# EasyEDA Pro project FC_F4_V2.0_2026-02-21.epro

# Schematic FC_F4_V2.0
Board Name: Board1; Create Date: 2026-01-18; Page Name: P1; Project Name: 莺飞; Schematic Name: Schematic8; Update Date: 2026-01-18; BladeWidth: 10; Company: 嘉立创EDA; Page Size: A4; RegionStart: 1; ShowBorder: 1; TitleBlock: 1; TitleBlockPosition: 3; Version: V1.0; XRegionCount: 6; YRegionCount: 4
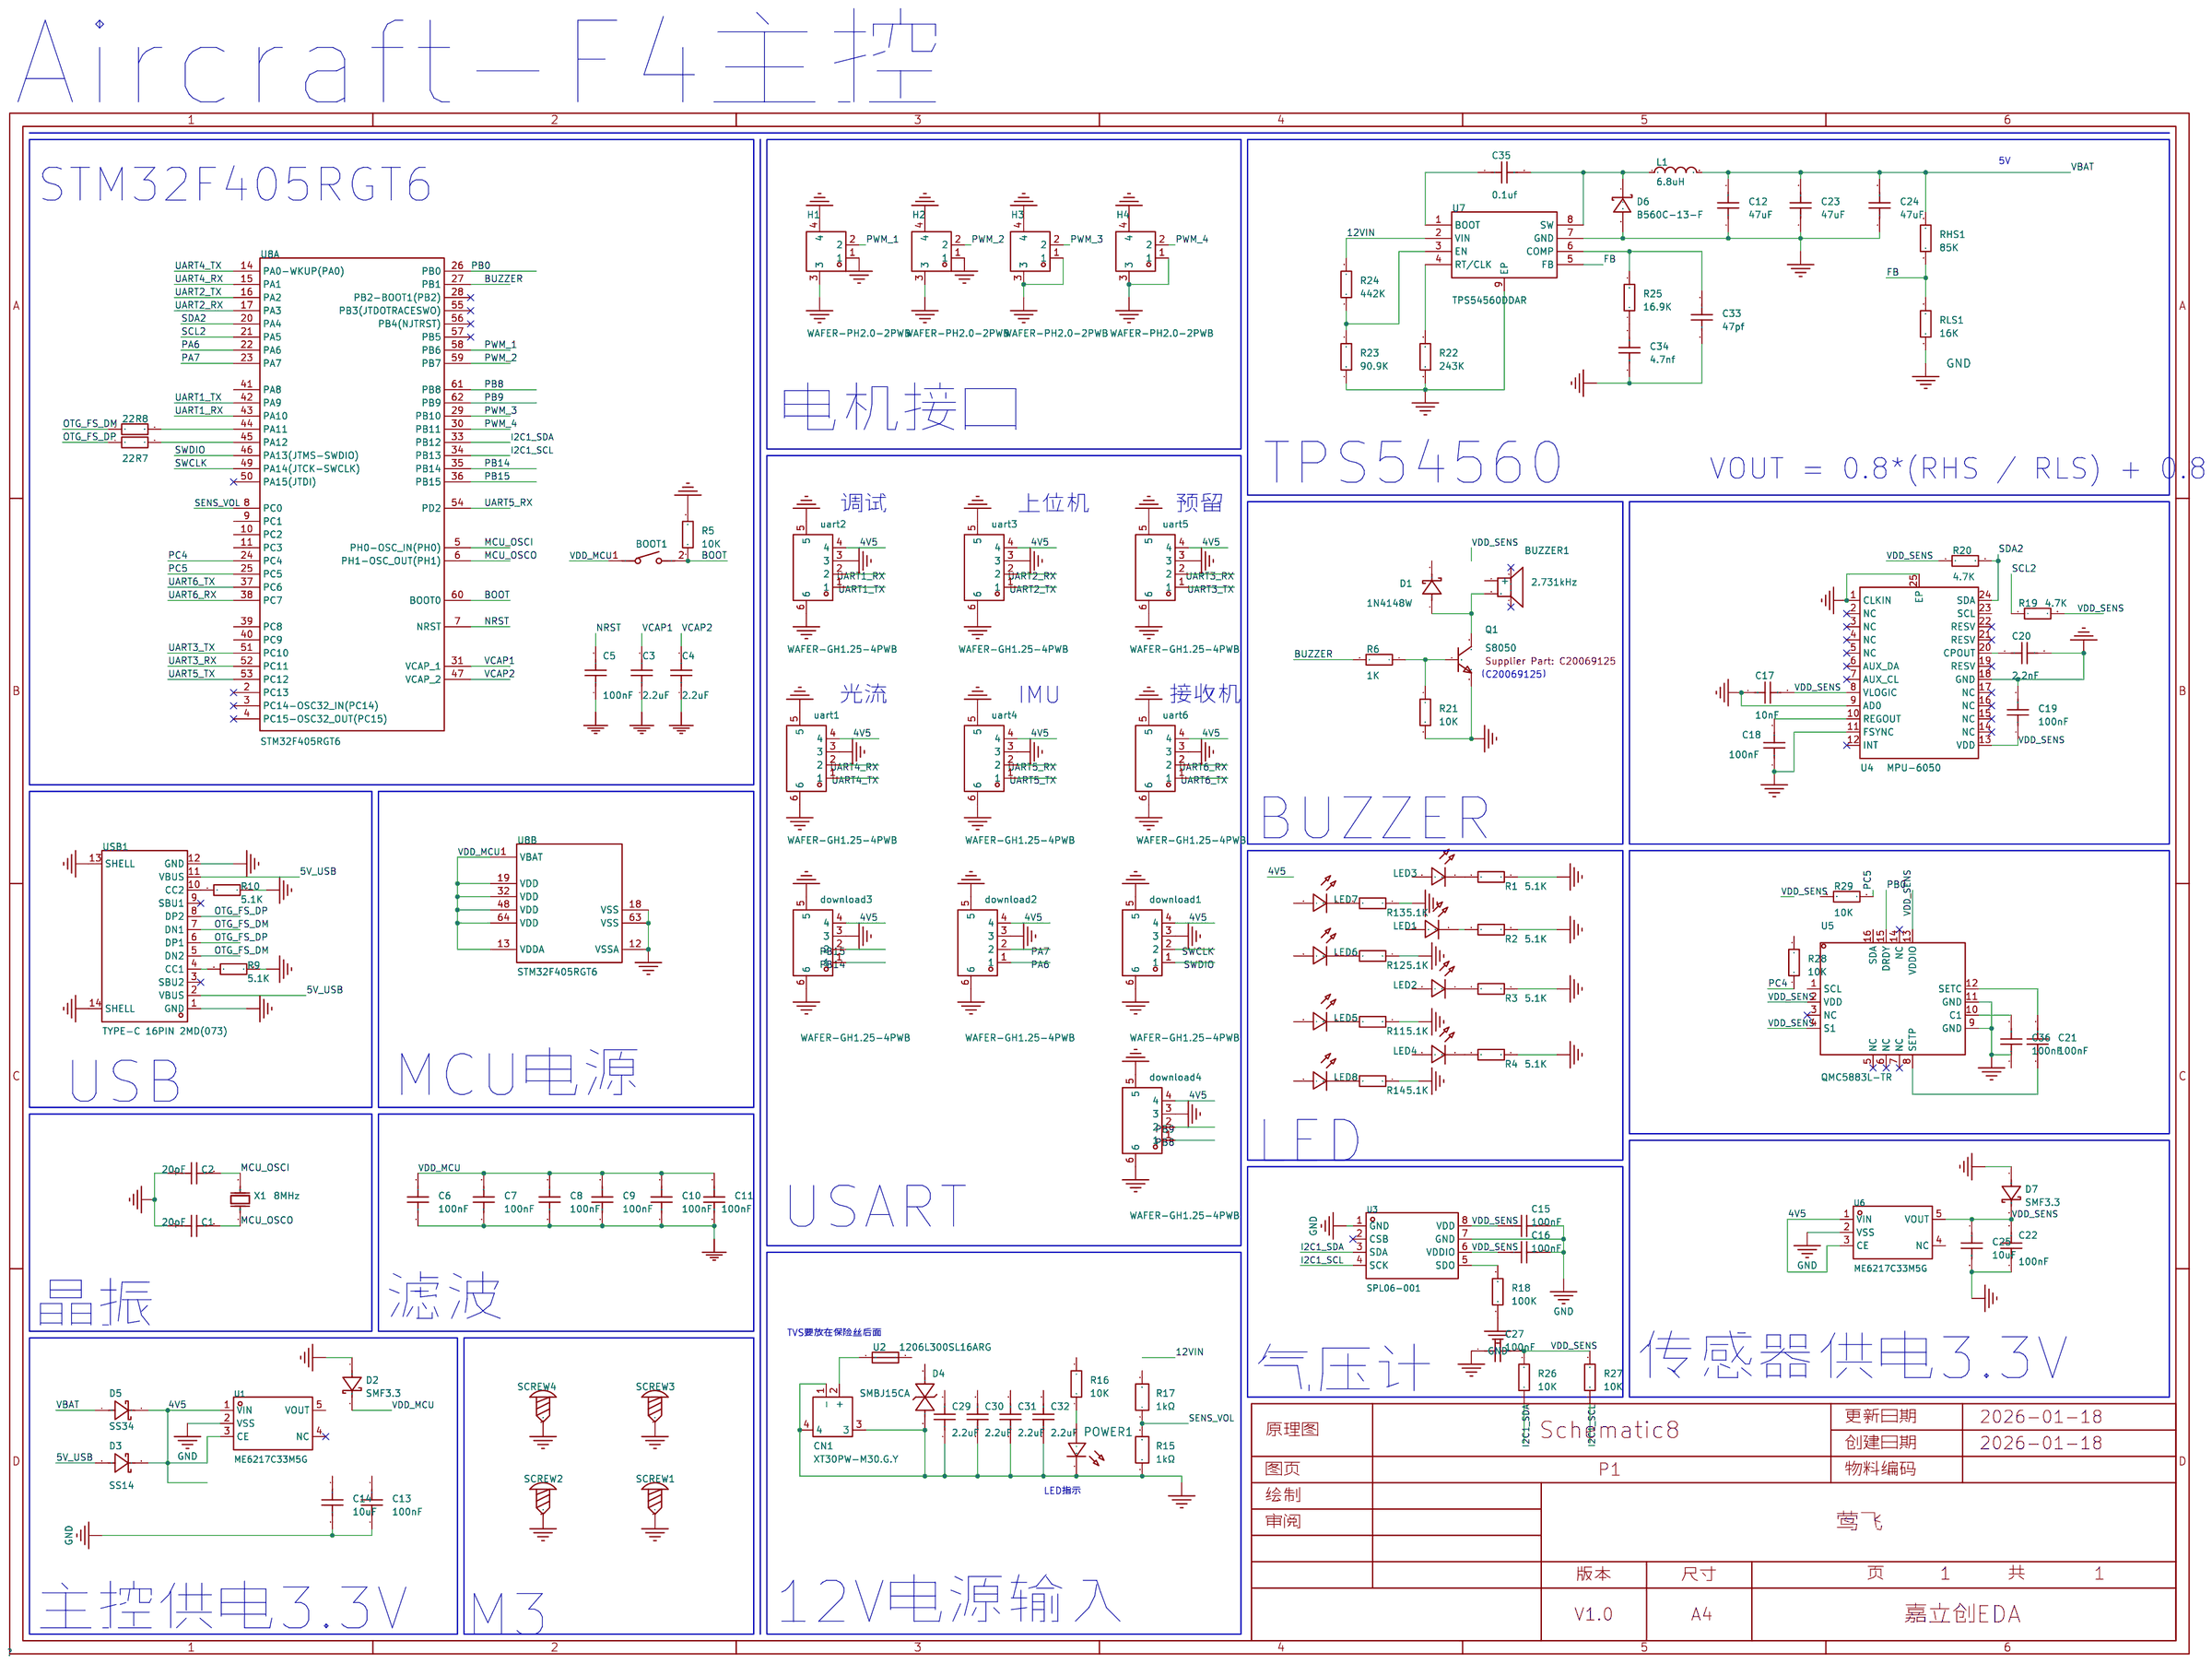
[diagram p0: schematic sheet]

## Parts
BOOT1  TS-1088-AR02016  [SW-SMD_L3.9-W3.0-P4.45_1]
BUZZER1  2.731kHz  [BUZ-SMD_4P-L7.5-W7.5-BR_1]
C1  20pF  [C0603]
C2  20pF  [C0603]
C3  2.2uF  [C0603]
C4  2.2uF  [C0603]
C5  100nF  [C0603]
C6  100nF  [C0603]
C7  100nF  [C0603]
C8  100nF  [C0603]
C9  100nF  [C0603]
C10  100nF  [C0603]
C11  100nF  [C0603]
C12  47uF  [C0805]
C13  100nF  [C0603]
C14  10uF  [C0603]
C15  100nF  [C0603]
C16  100nF  [C0603]
C17  10nF  [C0603]
C18  100nF  [C0603]
C19  100nF  [C0603]
C20  2.2nF  [C0603]
C21  100nF  [C0603]
C22  100nF  [C0603]
C23  47uF  [C0805]
C24  47uF  [C0805]
C25  10uF  [C0603]
C27  100nF  [C0603]
C29  2.2uF  [C1206]
C30  2.2uF  [C1206]
C31  2.2uF  [C1206]
C32  2.2uF  [C1206]
C33  47pf  [C0603]
C34  4.7nf  [C0603]
C35  0.1uf  [C0603]
C36  100nF  [C0603]
CN1  XT30PW-M30.G.Y  [CONN-TH_XT30PW-M]
D1  1N4148W  [SOD-123_L2.7-W1.6-LS3.7-FD_1]
D2  SMF3.3  [SOD-123FL_L3.0-W1.9-LS3.7-FD]
D3  SS14  [SMA_L4.3-W2.6-LS5.0-FD]
D4  SMBJ15CA  [SMB_L4.6-W3.6-LS5.4-BI]
D5  SS34  [SMA_L4.3-W2.6-LS5.0-FD]
D6  B560C-13-F  [SMC_L7.1-W6.2-LS8.1-RD]
D7  SMF3.3  [SOD-123FL_L3.0-W1.9-LS3.7-FD]
download1  WAFER-GH1.25-4PWB  [CONN-SMD_4P-P1.25_XUNPU_WAFER-GH1.25-4PWB_1]
download2  WAFER-GH1.25-4PWB  [CONN-SMD_4P-P1.25_XUNPU_WAFER-GH1.25-4PWB_1]
download3  WAFER-GH1.25-4PWB  [CONN-SMD_4P-P1.25_XUNPU_WAFER-GH1.25-4PWB_1]
download4  WAFER-GH1.25-4PWB  [CONN-SMD_4P-P1.25_XUNPU_WAFER-GH1.25-4PWB_1]
H1  WAFER-PH2.0-2PWB  [CONN-SMD_2P-P2.00_XUNPU_WAFER-PH2.0-2PWB_1]
H2  WAFER-PH2.0-2PWB  [CONN-SMD_2P-P2.00_XUNPU_WAFER-PH2.0-2PWB_1]
H3  WAFER-PH2.0-2PWB  [CONN-SMD_2P-P2.00_XUNPU_WAFER-PH2.0-2PWB_1]
H4  WAFER-PH2.0-2PWB  [CONN-SMD_2P-P2.00_XUNPU_WAFER-PH2.0-2PWB_1]
L1  6.8uH  [IND-SMD_L4.4-W4.2]
LED1  -  [LED_606]
LED2  -  [LED_606]
LED3  -  [LED_606]
LED4  -  [LED_606]
LED5  -  [LED_606]
LED6  -  [LED_606]
LED7  -  [LED_606]
LED8  -  [LED_606]
POWER1  -  [LED_604]
Q1  S8050  [SOT-23-3_L2.9-W1.3-P1.90-LS2.3-BR_1]
R1  5.1K  [R0603_5]
R2  5.1K  [R0603_5]
R3  5.1K  [R0603_5]
R4  5.1K  [R0603_5]
R5  10K  [R0603]
R6  1K  [R0603]
R7  22  [R0402]
R8  22  [R0402]
R9  5.1K  [R0603]
R10  5.1K  [R0603]
R11  5.1K  [R0603_5]
R12  5.1K  [R0603_5]
R13  5.1K  [R0603_5]
R14  5.1K  [R0603_5]
R15  1kΩ  [R2512]
R16  10K  [R0603]
R17  1kΩ  [R2512]
R18  100K  [R0603]
R19  4.7K  [R0603]
R20  4.7K  [R0603]
R21  10K  [R0603]
R22  243K  [R0603]
R23  90.9K  [R0603]
R24  442K  [R0603]
R25  16.9K  [R0603]
R26  10K  [R0603]
R27  10K  [R0603]
R28  10K  [R0603]
R29  10K  [R0603]
RHS1  85K  [R0603]
RLS1  16K  [R0603]
SCREW1  -  [M3螺丝_2]
SCREW2  -  [M3螺丝_2]
SCREW3  -  [M3螺丝_2]
SCREW4  -  [M3螺丝_2]
U1  ME6217C33M5G  [SOT-23-5_L3.0-W1.7-P0.95-LS2.8-BR]
U2  1206L300SL16ARG  [L1206]
U3  SPL06-001  [SENSOR-SMD_SPL06-001]
U4  MPU-6050  [QFN-24_L4.0-W4.0-P0.50-BL-EP2.7]
U5  QMC5883L-TR  [LGA-16_L3.0-W3.0-P0.50-BL_SQ]
U6  ME6217C33M5G  [SOT-23-5_L3.0-W1.7-P0.95-LS2.8-BR]
U7  TPS54560DDAR  [SOIC-8_L5.0-W4.0-P1.27-LS6.0-BL-EP2.0]
U8  STM32F405RGT6  [LQFP-64_L10.0-W10.0-P0.50-LS12.0-BL_1]  (sections 1,2)
uart1  WAFER-GH1.25-4PWB  [CONN-SMD_4P-P1.25_XUNPU_WAFER-GH1.25-4PWB_1]
uart2  WAFER-GH1.25-4PWB  [CONN-SMD_4P-P1.25_XUNPU_WAFER-GH1.25-4PWB_1]
uart3  WAFER-GH1.25-4PWB  [CONN-SMD_4P-P1.25_XUNPU_WAFER-GH1.25-4PWB_1]
uart4  WAFER-GH1.25-4PWB  [CONN-SMD_4P-P1.25_XUNPU_WAFER-GH1.25-4PWB_1]
uart5  WAFER-GH1.25-4PWB  [CONN-SMD_4P-P1.25_XUNPU_WAFER-GH1.25-4PWB_1]
uart6  WAFER-GH1.25-4PWB  [CONN-SMD_4P-P1.25_XUNPU_WAFER-GH1.25-4PWB_1]
USB1  TYPE-C 16PIN 2MD(073)  [USB-C-SMD_TYPE-C-6PIN-2MD-073_2]
X1  8MHz  [OSC-SMD_L5.0-W3.2_1]

## Library data of the parts
BOOT1 = TS-1088-AR02016_1: LCSC Part Name: 4*3*2mm 立贴 轻触开关; Supplier Part: C720477; Manufacturer: XUNPU(讯普); Supplier Footprint: SMD; JLCPCB Part Class: 扩展库; Datasheet: https://atta.szlcsc.com/upload/public/pdf/source/20200810/C720475_60D09DD6C54279ADDB2DC25100F1CC11.pdf; Supplier: LCSC; Contact Current: 50mA; Voltage Rating (DC): 12V; Insulation Resistance: 100MΩ; Circuit: 单刀单掷; Mounting Style: 立贴; Actuator Style: 圆形按钮; Actuator/Cap Color: 黑色; Operating Force: 160gf@±50gf; Mechanical Life: 10万次; Operating Temperature: -30℃~+80℃; Pin Style: SMD接片; Switch Length: 4mm; Switch Width: 3mm; Switch Height: 2mm; Strike Gundam: 否
BUZZER1 = HYG-7525A_1: LCSC Part Name: 贴片无源蜂鸣器; Supplier Part: C7544812; Manufacturer: HYDZ(华宇); Manufacturer Part: HYG-7525A; Supplier Footprint: SMD,7.5x7.5mm; Datasheet: https://item.szlcsc.com/datasheet/HYG-7525A/8653386.html; Supplier: LCSC; Current Consumption: 90mA; Sound Pressure Level(SPL): 85dB
C1 C2 = HHV0603G0200J251NTHJ_1: 容值:20pF;额定电压:250V;材质(温度系数):C0G;; LCSC Part Name: 20pF 250V; Supplier Part: C5186672; Manufacturer: Chinocera(华瓷); Manufacturer Part: HHV0603G0200J251NTHJ; Supplier Footprint: 0603; JLCPCB Part Class: 扩展库; Datasheet: https://atta.szlcsc.com/upload/public/pdf/source/20240320/7913236AA18747E5EA43CE828F8C8ED9.pdf; Supplier: LCSC; Voltage Rated: 250V; Temperature Coefficient: C0G
C3-C11 C13-C22 C25 C27 C33-C36 = CAP_0603: Supplier Footprint: 0603
C12 C23 C24 = CAP_0805: Supplier Footprint: 0805
C29-C32 = CAP_1206: Supplier Footprint: 1206
CN1 = XT30PW-M30.G.Y: LCSC Part Name: AMASS(艾迈斯)航模插头 卧式弯脚 XT30PW-M公头; Supplier Part: C431092; Manufacturer: AMASS(艾迈斯); JLCPCB Part Class: Extended Part; Datasheet: https://item.szlcsc.com/datasheet/XT30PW-M30.G.Y/426930.html; Supplier: LCSC; Type: 航模插头; RatedVoltage: DC 500V; InterfaceType: 公头; RatedCurrent: 15A; RecommendedWireGauge: 16/18/20AWG; contact resistance: 1.2mΩ; specifications: 2pin
D1 = 1N4148W_C7420318_1: Supplier Part: C7420318; Manufacturer: R+O(宏嘉诚); Supplier Footprint: SOD-123; Datasheet: https://item.szlcsc.com/datasheet/1N4148W/8397140.html; Supplier: LCSC; Diode Configuration: 独立式; Voltage - Forward(Vf@If): 1.25V@150mA; Voltage - DC Reverse(Vr): 100V; Current - Rectified: 150mA; Pd - Power Dissipation: 400mW; Reverse Leakage Current (Ir): 1uA@75V; Reverse Recovery Time (trr): 4ns; Operating Junction Temperature Range: -55℃~+150℃; Non-Repetitive Peak Forward Surge Current: 2A
D2 D7 = SMF3.3: LCSC Part Name: TVS 3.3V截止 峰值浪涌电流：30A; Supplier Part: C2649858; Manufacturer: Littelfuse(美国力特); Supplier Footprint: SOD-123FL; JLCPCB Part Class: Extended Part; Datasheet: https://item.szlcsc.com/datasheet/SMF3.3/2741767.html; Supplier: LCSC; Reverse Stand-Off Voltage (Vrwm): 3.3V; Clamping Voltage: 6.8V; Peak Pulse Current (Ipp): 30A; Peak Pulse Power Dissipation (Ppp): 200W; Voltage - Breakdown: 3.4V; Reverse Leakage Current (Ir): 500nA; Operating Temperature: -55℃~+150℃; level of protection: IEC 61000-4-4；IEC 61000-4-2; Type: TVS
D3 = SS14_C7420316: 二极管配置:独立式;正向压降(Vf):550mV@1.0A;直流反向耐压(Vr):40V;整流电流:1A;; LCSC Part Name: 电压:40V 电流:1A; Supplier Part: C7420316; Manufacturer: R+O(宏嘉诚); Supplier Footprint: SMA(DO-214AC); JLCPCB Part Class: 扩展库; Datasheet: https://item.szlcsc.com/datasheet/SS14/8397138.html; Supplier: LCSC; Diode Configuration: 独立式; Voltage - Forward(Vf@If): 550mV@1.0A; Voltage - DC Reverse(Vr): 40V; Current - Rectified: 1A; Reverse Leakage Current (Ir): 200uA@40V; Operating Junction Temperature Range: -55℃~+150℃; Non-Repetitive Peak Forward Surge Current: 30A
D4 = SMBJ15CA_C19077570: 极性:双向;反向截止电压(Vrwm):15V;钳位电压:24.4V;峰值脉冲电流(Ipp):24.59A@10/1000us;峰值脉冲功率(Ppp):600W@10/1000us;击穿电压:18.5V;; LCSC Part Name: 双向TVS 15V截止 峰值浪涌电流：24.59A@10/1000us; Supplier Part: C19077570; Manufacturer: R+O(宏嘉诚); Supplier Footprint: DO-214AA(SMB); JLCPCB Part Class: 扩展库; Datasheet: https://item.szlcsc.com/datasheet/SMBJ15CA/20275655.html; Supplier: LCSC; Polarity: 双向; Reverse Stand-Off Voltage (Vrwm): 15V; Clamping Voltage: 24.4V; Peak Pulse Current (Ipp): 24.59A@10/1000us; Peak Pulse Power Dissipation (Ppp): 600W@10/1000us; Voltage - Breakdown: 18.5V; Reverse Leakage Current (Ir): 5uA; Operating Temperature: -55℃~+150℃; level of protection: IEC 61000-4-2; Type: TVS
D5 = SS34_C7420365: 二极管配置:独立式;正向压降(Vf):550mV@3.0A;直流反向耐压(Vr):40V;整流电流:3A;; LCSC Part Name: 电压:40V 电流:3A; Supplier Part: C7420365; Manufacturer: R+O(宏嘉诚); Supplier Footprint: SMA(DO-214AC); JLCPCB Part Class: Extended Part; Datasheet: https://item.szlcsc.com/datasheet/SS34/8397187.html; Supplier: LCSC; Diode Configuration: 独立式; Voltage - Forward(Vf@If): 550mV@3.0A; Voltage - DC Reverse(Vr): 40V; Current - Rectified: 3A; Reverse Leakage Current (Ir): 200uA@40V
D6 = B560C-13-F: 正向压降(Vf):700mV@5A;直流反向耐压(Vr):60V;整流电流:5A;; LCSC Part Name: 电压:60V 电流:5A; Supplier Part: C85100; Manufacturer: DIODES(美台); Supplier Footprint: SMC(DO-214AB); JLCPCB Part Class: Extended Part; Datasheet: https://item.szlcsc.com/datasheet/B560C-13-F/86272.html; Supplier: LCSC; Voltage - Forward(Vf@If): 700mV@5A; Voltage - DC Reverse(Vr): 60V; Current - Rectified: 5A; Reverse Leakage Current (Ir): 500uA@60V; Operating Junction Temperature Range: -55℃~+150℃; Non-Repetitive Peak Forward Surge Current: 100A
download1-download4 uart1-uart6 = WAFER-GH1.25-4PWB_1: 插针结构:1x4P;间距:1.25mm;安装方式:卧贴;参考系列:GH;总PIN数:4P;排数:1;每排PIN数:4;行距:-;额定电流:1A;触头材质:黄铜;触头镀层:锡;工作温度:-25℃~+85℃;; LCSC Part Name: 1x4P 间距:1.25mm 卧贴 系列:GH; Supplier Part: C3029379; Manufacturer: XUNPU(讯普); Supplier Footprint: SMD,P=1.25mm,卧贴; JLCPCB Part Class: Extended Part; Datasheet: https://item.szlcsc.com/datasheet/WAFER-GH1.25-4PWB/3561391.html; Supplier: LCSC; Pins Structure: 1x4P; Pitch: 1.25mm; Mounting Type: 卧贴; Reference Series: GH; Number of Pins: 4P; Number of Rows: 1; Number of PINs Per Row: 4; Current Rating: 1A; Contact Material: 黄铜; Contact Plating: 锡; Operating Temperature: -25℃~+85℃; Voltage Rating: 125V; Plastic Material: LCP; Supplementary Features: 辅助焊脚; Color: 米色; Z-Height of the Board: 4.35mm; X-Length of Bottom Edge on Board (Spacing Line): 8.25mm; Y-Width of Bottom Edge on Board: 5mm
H1-H4 = WAFER-PH2.0-2PWB_1: 插针结构:1x2P;间距:2mm;安装方式:卧贴;参考系列:PH;总PIN数:2P;排数:1;每排PIN数:2;行距:-;额定电流:2A;触头材质:黄铜;触头镀层:锡;工作温度:-25℃~+85℃;; LCSC Part Name: 1x2P 间距:2mm 卧贴 系列:PH; Supplier Part: C3029440; Manufacturer: XUNPU(讯普); Supplier Footprint: SMD,P=2mm,卧贴; JLCPCB Part Class: Extended Part; Datasheet: https://item.szlcsc.com/datasheet/WAFER-PH2.0-2PWB/3561452.html; Supplier: LCSC; Pins Structure: 1x2P; Pitch: 2mm; Mounting Type: 卧贴; Reference Series: PH; Number of Pins: 2P; Number of Rows: 1; Number of PINs Per Row: 2; Current Rating: 2A; Contact Material: 黄铜; Contact Plating: 锡; Operating Temperature: -25℃~+85℃; Voltage Rating: 250V; Plastic Material: LCP; Supplementary Features: 辅助焊脚; Color: 米色; Z-Height of the Board: 5.6mm; X-Length of Bottom Edge on Board (Spacing Line): 8mm; Y-Width of Bottom Edge on Board: 7.59mm
L1 = FAUL0420-6R8MT: 电感值:6.8uH;精度:±20%;额定电流:2.4A;饱和电流(Isat):2.5A;类型:-;; LCSC Part Name: 6.8uH ±20% 2.5A; Supplier Part: C3040386; Manufacturer: cjiang(长江微电); Supplier Footprint: SMD,4.4x4.2mm; JLCPCB Part Class: Extended Part; Datasheet: https://item.szlcsc.com/datasheet/FAUL0420-6R8MT/3597563.html; Supplier: LCSC; Tolerance: ±20%; Current Rating: 2.4A; Current - Saturation(Isat): 2.5A; DC Resistance(DCR): 175mΩ; Ratings: AEC-Q200
LED1-LED8 = LED_0603-G_1: Supplier Footprint: 0603
POWER1 = LED_0603-R_1: Supplier Footprint: 0603
Q1 = S8050_C20069125_1: LCSC Part Name: hFE:200-350，丝印:J3Y S8050; Supplier Part: C20069125; Manufacturer: R+O(宏嘉诚); Supplier Footprint: SOT-23; Datasheet: https://item.szlcsc.com/datasheet/S8050/21397163.html; Supplier: LCSC; type: NPN; Current - Collector(Ic): 500mA; Collector - Emitter Voltage VCEO: 25V; Pd - Power Dissipation: 300mW; DC Current Gain: 120@50mA,1.0V; Transition frequency(fT): 100MHz; Current - Collector Cutoff: 100nA; Vce Saturation(VCE(sat)): 600mV@500mA,50mA; Operating Temperature: -55℃~+150℃; Emitter-Base Voltage(Vebo): 5V
R1-R4 R11-R14 = Res_605: Supplier Footprint: 0603
R5 R6 R9 R10 R16 R18-R29 RHS1 RLS1 = Res_0603: Supplier Footprint: 0603
R7 R8 = Res_0402: Supplier Footprint: 0402
R15 R17 = HoCR2512-2W-1KR-5%: 电阻类型:陶瓷电阻;阻值:1kΩ;精度:±5%;功率:2W;温度系数:-;; LCSC Part Name: 陶瓷电阻 1kΩ ±5% 2W; Supplier Part: C5123626; Manufacturer: Milliohm(毫欧); Supplier Footprint: 2512; JLCPCB Part Class: Extended Part; Datasheet: https://atta.szlcsc.com/upload/public/pdf/source/20220815/B2B22E44E42BA53361D26D7F91BAD205.pdf; Supplier: LCSC; Type: 陶瓷电阻; Tolerance: ±5%; Power(Watts): 2W
SCREW1-SCREW4 = M3螺丝_2: Supplier Footprint: 插件
U1 U6 = ME6217C33M5G: 输出类型:固定;输出极性:正;最大输入电压:7V;输出电压:3.3V;输出电流:800mA;电源纹波抑制比(PSRR):65dB@(1kHz);; Supplier Part: C427602; Manufacturer: MICRONE(南京微盟); Supplier Footprint: SOT-23-5; JLCPCB Part Class: 扩展库; Datasheet: https://atta.szlcsc.com/upload/public/pdf/source/20190910/C427602_D4B9162A2E9D9EF57C60010DFDECEF37.pdf; Supplier: LCSC; Output Type: 固定; Output Polarity: 正; Number of Outputs: 1; Maximum Input Voltage: 7V; Output Voltage: 3.3V; Dropout Voltage: 180mV@(300mA); Output Current: 800mA; Power Supply Rejection Ratio (PSRR): 65dB@(1kHz)
U2 = 1206L300SL16ARG: LCSC Part Name: 16V 3.00A 1206 低电阻自恢复自恢复; Supplier Part: C28326707; Manufacturer: LUTE(陆特); Supplier Footprint: 1206; JLCPCB Part Class: Extended Part; Datasheet: https://item.szlcsc.com/datasheet/1206L300SL16ARG/30063183.html; Supplier: LCSC; Voltage - Max: 16V; Current - Max: 50A; Hold Current: 3A; Trip Current: 6A; Power Dissipation: 1.2W; Resistance - Initial (Ri) (Min): 3mΩ; Resistance - Post Trip (R1) (Max): 30mΩ; Time to Trip(Max): 5s; Operating Temperature: -40℃~+85℃
U3 = SPL06-001_C2684428: LCSC Part Name: 普通气压传感器; Supplier Part: C2684428; Manufacturer: Goertek(歌尔); Supplier Footprint: SMD-8P,2x2.5mm; JLCPCB Part Class: 扩展库; Datasheet: https://atta.szlcsc.com/upload/public/pdf/source/20210120/C2684428_7EA58BBCA3793458F617124FBE4BF8F1.pdf; Supplier: LCSC
U4 = MPU-6050: 传感器类型:加速度计陀螺仪;; Supplier Part: C24112; Manufacturer: TDK InvenSense(应美盛); Supplier Footprint: QFN-24-EP(4x4); JLCPCB Part Class: 扩展库; Datasheet: https://atta.szlcsc.com/upload/public/pdf/source/20140425/1457707046159.pdf; Supplier: LCSC; Sensor Type: 加速度计陀螺仪; Operating Temperature: -40℃~+85℃
U5 = QMC5883L-TR: 三轴磁传感器; LCSC Part Name: 三轴磁传感器; Supplier Part: C192585; Supplier Footprint: LGA-16; JLCPCB Part Class: Extended Part; Supplier: LCSC
U7 = TPS54560DDAR: 功能类型:降压型;输出类型:可调;工作电压:4.5V~60V;输出电压:800mV~58.8V;输出电流:5A;; LCSC Part Name: 4.5V至60V输入,5A降压DC-DC转换器; Supplier Part: C31966; Manufacturer: TI(德州仪器); Supplier Footprint: SOIC-8-EP; JLCPCB Part Class: Extended Part; Datasheet: https://www.ti.com/cn/lit/gpn/tps54560; Supplier: LCSC; Function: 降压型; Output Type: 可调; Input Voltage: 4.5V~60V; Output Voltage: 800mV~58.8V; Output Current: 5A; Switching Frequency: 2.5MHz; Operating Temperature: -40℃~+150℃@(TJ); Synchronous Rectification: 否; Number of Outputs: 1; Topology: 降压式; Switch tube (built-in/external): 内置
U8 = STM32F405RGT6_1: CPU内核:ARM-M4;CPU最大主频:168MHz;应用领域:-;; LCSC Part Name: 带DSP和FPU的高性能基础系列ARM Cortex-M4 MCU，具有1 MB Flash、168 MHz CPU和ART加速器; Supplier Part: C15742; Manufacturer: ST(意法半导体); Supplier Footprint: LQFP-64(10x10); JLCPCB Part Class: 扩展库; Datasheet: https://item.szlcsc.com/datasheet/STM32F405RGT6/16424.html; Supplier: LCSC; CPU Core: ARM-M4; CPU Maximum Speed: 168MHz; Program Storage Size: 1MB; Program Memory Type: FLASH; Number of I/O: 51; ADC (Bit): 12bit; DAC (Bit): 12bit; Voltage - Supply: 1.8V~3.6V
USB1 = TYPE-C 16PIN 2MD(073)_2: LCSC Part Name: Type-C 母 卧贴; Supplier Part: C2765186; Manufacturer: SHOU HAN(首韩); Supplier Footprint: SMD; JLCPCB Part Class: 扩展库; Datasheet: https://atta.szlcsc.com/upload/public/pdf/source/20211123/39B17C16241EAC15C5E277BDA434118E.pdf; Supplier: LCSC; Connector Type: Type-C; Gender: 母; Number of Ports: 1; Number of Contacts: 16P; Mounting Style: 卧贴; Current Rating - Power (Max): 5A; Operating Temperature Range: -25℃~+85℃
X1 = TAXM8M2QLFCDT1T_1: 晶振类型:贴片晶振;频率:8MHz;常温频差:±30ppm;外接负载电容:20pF;频率稳定度(全温):±20ppm;; LCSC Part Name: 8MHz ±30ppm 20pF; Supplier Part: C122522; Manufacturer: YJX(雅晶鑫); Manufacturer Part: TAXM8M2QLFCDT1T; Supplier Footprint: SMD5032; Datasheet: https://atta.szlcsc.com/upload/public/pdf/source/20220113/59EE8A0E7B9F67FF1BF3C454890DE4E5.pdf; Supplier: LCSC; Crystal Type: 贴片晶振; Normal temperature Frequency Tolerance: ±30ppm; External load capacitor: 20pF; Frequency Stability(Full temperature range): ±20ppm; Equivalent Series Resistance (ESR): 80Ω; Operating Temperature: -40℃~+85℃

## Nets
4V5: D3.2(K) D5.2(K) download1.4 download2.4 download3.4 download4.4 LED1.2(A) LED2.2(A) LED3.2(A) LED4.2(A) LED5.2(A) LED6.2(A) LED7.2(A) LED8.2(A) U1.1(VIN) U1.3(CE) U6.1(VIN) U6.3(CE) uart1.4 uart2.4 uart3.4 uart4.4 uart5.4 uart6.4
5V_USB: D3.1(A) USB1.2(VBUS) USB1.11(VBUS)
12VIN: C29.2 C30.2 C31.2 C32.2 D4.2 R16.2 R17.2 R24.2 U2.2 U7.2(VIN)
GND: C1.1 C2.1 C3.1 C4.1 C5.1 C6.1 C7.1 C8.1 C9.1 C10.1 C11.1 C12.1 C13.2 C14.2 C15.2 C16.2 C17.1 C18.1 C19.2 C20.2 C22.1 C23.1 C24.1 C25.2 C27.1 C29.1 C30.1 C31.1 C32.1 C33.1 C34.2 C36.1 CN1.1(-) CN1.3 CN1.4 D2.1(A) D4.1 D6.2(A) D7.1(A) download1.3 download1.5 download1.6 download2.3 download2.5 download2.6 download3.3 download3.5 download3.6 download4.3 download4.5 download4.6 H1.1 H1.3 H1.4 H2.1 H2.3 H2.4 H3.1 H3.3 H3.4 H4.1 H4.3 H4.4 POWER1.1(C) Q1.2(E) R1.1 R2.1 R3.1 R4.1 R5.2 R9.2 R10.2 R11.1 R12.1 R13.1 R14.1 R15.1 R18.1 R21.2 R22.1 R23.1 RLS1.1 SCREW1.1 SCREW2.1 SCREW3.1 SCREW4.1 U1.2(VSS) U3.1(GND) U3.7(GND) U4.1(CLKIN) U4.9(AD0) U4.11(FSYNC) U4.18(GND) U4.25(EP) U5.9(GND) U5.11(GND) U6.2(VSS) U7.7(GND) U7.9(EP) U8.12(VSSA) U8.18(VSS) U8.63(VSS) uart1.3 uart1.5 uart1.6 uart2.3 uart2.5 uart2.6 uart3.3 uart3.5 uart3.6 uart4.3 uart4.5 uart4.6 uart5.3 uart5.5 uart5.6 uart6.3 uart6.5 uart6.6 USB1.1(GND) USB1.12(GND) USB1.13(SHELL) USB1.14(SHELL)
VBAT: C12.2 C23.2 C24.2 D5.1(A) L1.2 RHS1.2
VDD_MCU: BOOT1.1 C6.2 C7.2 C8.2 C9.2 C10.2 C11.2 C13.1 C14.1 D2.2(K) U1.5(VOUT) U8.1(VBAT) U8.13(VDDA) U8.19(VDD) U8.32(VDD) U8.48(VDD) U8.64(VDD)
VDD_SENS: BUZZER1.1(+) C15.1 C16.1 C17.2 C19.1 C22.2 C25.1 C27.2 D1.2(K) D7.2(K) R19.2 R20.1 R26.2 R27.2 R28.2 R29.2 U3.6(VDDIO) U3.8(VDD) U4.8(VLOGIC) U4.13(VDD) U5.2(VDD) U5.4(S1) U5.13(VDDIO) U6.5(VOUT)
BOOT: BOOT1.2 R5.1 U8.60(BOOT0)
BUZZER: R6.2 U8.27(PB1)
FB: RHS1.1 RLS1.2 U7.5(FB)
I2C1_SCL: R27.1 U3.4(SCK) U8.34(PB13)
I2C1_SDA: R26.1 U3.3(SDA) U8.33(PB12)
MCU_OSCI: C2.2 U8.5(PH0-OSC_IN(PH0)) X1.2(OSC2)
MCU_OSCO: C1.2 U8.6(PH1-OSC_OUT(PH1)) X1.1(OSC1)
NRST: C5.2 U8.7(NRST)
OTG_FS_DM: R8.1 USB1.5(DN2) USB1.7(DN1)
OTG_FS_DP: R7.1 USB1.6(DP1) USB1.8(DP2)
PA6: download2.1 U8.22(PA6)
PA7: download2.2 U8.23(PA7)
PB0: U5.15(DRDY) U8.26(PB0)
PB8: download4.1 U8.61(PB8)
PB9: download4.2 U8.62(PB9)
PB14: download3.1 U8.35(PB14)
PB15: download3.2 U8.36(PB15)
PC4: R28.1 U5.1(SCL) U8.24(PC4)
PC5: R29.1 U5.16(SDA) U8.25(PC5)
PWM_1: H1.2 U8.58(PB6)
PWM_2: H2.2 U8.59(PB7)
PWM_3: H3.2 U8.29(PB10)
PWM_4: H4.2 U8.30(PB11)
SCL2: R19.1 U4.23(SCL) U8.21(PA5)
SDA2: R20.2 U4.24(SDA) U8.20(PA4)
SENS_VOL: R15.2 R17.1 U8.8(PC0)
SWCLK: download1.2 U8.49(PA14(JTCK-SWCLK))
SWDIO: download1.1 U8.46(PA13(JTMS-SWDIO))
UART1_RX: U8.43(PA10) uart2.2
UART1_TX: U8.42(PA9) uart2.1
UART2_RX: U8.17(PA3) uart3.2
UART2_TX: U8.16(PA2) uart3.1
UART3_RX: U8.52(PC11) uart5.2
UART3_TX: U8.51(PC10) uart5.1
UART4_RX: U8.15(PA1) uart1.2
UART4_TX: U8.14(PA0-WKUP(PA0)) uart1.1
UART5_RX: U8.54(PD2) uart4.2
UART5_TX: U8.53(PC12) uart4.1
UART6_RX: U8.38(PC7) uart6.2
UART6_TX: U8.37(PC6) uart6.1
VCAP1: C3.2 U8.31(VCAP_1)
VCAP2: C4.2 U8.47(VCAP_2)
$1N4: C34.1 R25.1
$1N42: LED8.1(C) R14.2
$1N44: LED7.1(C) R13.2
$1N46: LED6.1(C) R12.2
$1N48: LED5.1(C) R11.2
$1N53: R10.1 USB1.10(CC2)
$1N70: LED4.1(C) R4.2
$1N71: LED2.1(C) R3.2
$1N72: LED1.1(C) R2.2
$1N73: LED3.1(C) R1.2
$1N91: R18.2 U3.5(SDO)
$1N97: C35.2 D6.1(K) L1.1 U7.8(SW)
$1N100: C35.1 U7.1(BOOT)
$1N104: C33.2 R25.2 U7.6(COMP)
$1N105: R22.2 U7.4(RT/CLK)
$1N107: R23.2 R24.1 U7.3(EN)
$1N109: POWER1.2(A) R16.1
$1N110: CN1.2(+) U2.1
$1N156: R9.1 USB1.4(CC1)
$1N178: Q1.1(B) R6.1 R21.1
$1N179: BUZZER1.2 D1.1(A) Q1.3(C)
$1N209: R7.2 U8.45(PA12)
$1N210: R8.2 U8.44(PA11)
$1N234: C18.2 U4.10(REGOUT)
$1N238: C20.1 U4.20(CPOUT)
$1N244: C21.2 U5.12(SETC)
$1N245: C21.1 U5.8(SETP)
$1N247: C36.2 U5.10(C1)

Not connected (* = marked no-connect by the designer): BUZZER1 3* 4*; U1 4(NC)*; U3 2(CSB)*; U4 2(NC)* 3(NC)* 4(NC)* 5(NC)* 6(AUX_DA)* 7(AUX_CL)* 12(INT)* 14(NC)* 15(NC)* 16(NC)* 17(NC)* 19(RESV)* 21(RESV)* 22(RESV)*; U5 3(NC)* 5(NC)* 6(NC)* 7(NC)* 14(NC)*; U6 4(NC); U8 2(PC13)* 3(PC14-OSC32_IN(PC14))* 4(PC15-OSC32_OUT(PC15))* 9(PC1) 10(PC2) 11(PC3) 28(PB2-BOOT1(PB2))* 39(PC8) 40(PC9) 41(PA8) 50(PA15(JTDI))* 55(PB3(JTDOTRACESWO))* 56(PB4(NJTRST))* 57(PB5)*; USB1 3(SBU2)* 9(SBU1)*

## Notes on the sheet
- Aircraft-F4主控
- 5V
- STM32F405RGT6
- 电机接口
- TPS54560
- VOUT = 0.8*(RHS / RLS) + 0.8
- 调试
- 上位机
- 预留
- （C20069125）
- 光流
- IMU
- 接收机
- BUZZER
- USB
- MCU电源
- LED
- USART
- 滤波
- 晶振
- TVS要放在保险丝后面
- 传感器供电3.3V
- 气压计
- LED指示
- 主控供电3.3V
- M3
- 12V电源输入

# Board FC_F4_V2.0
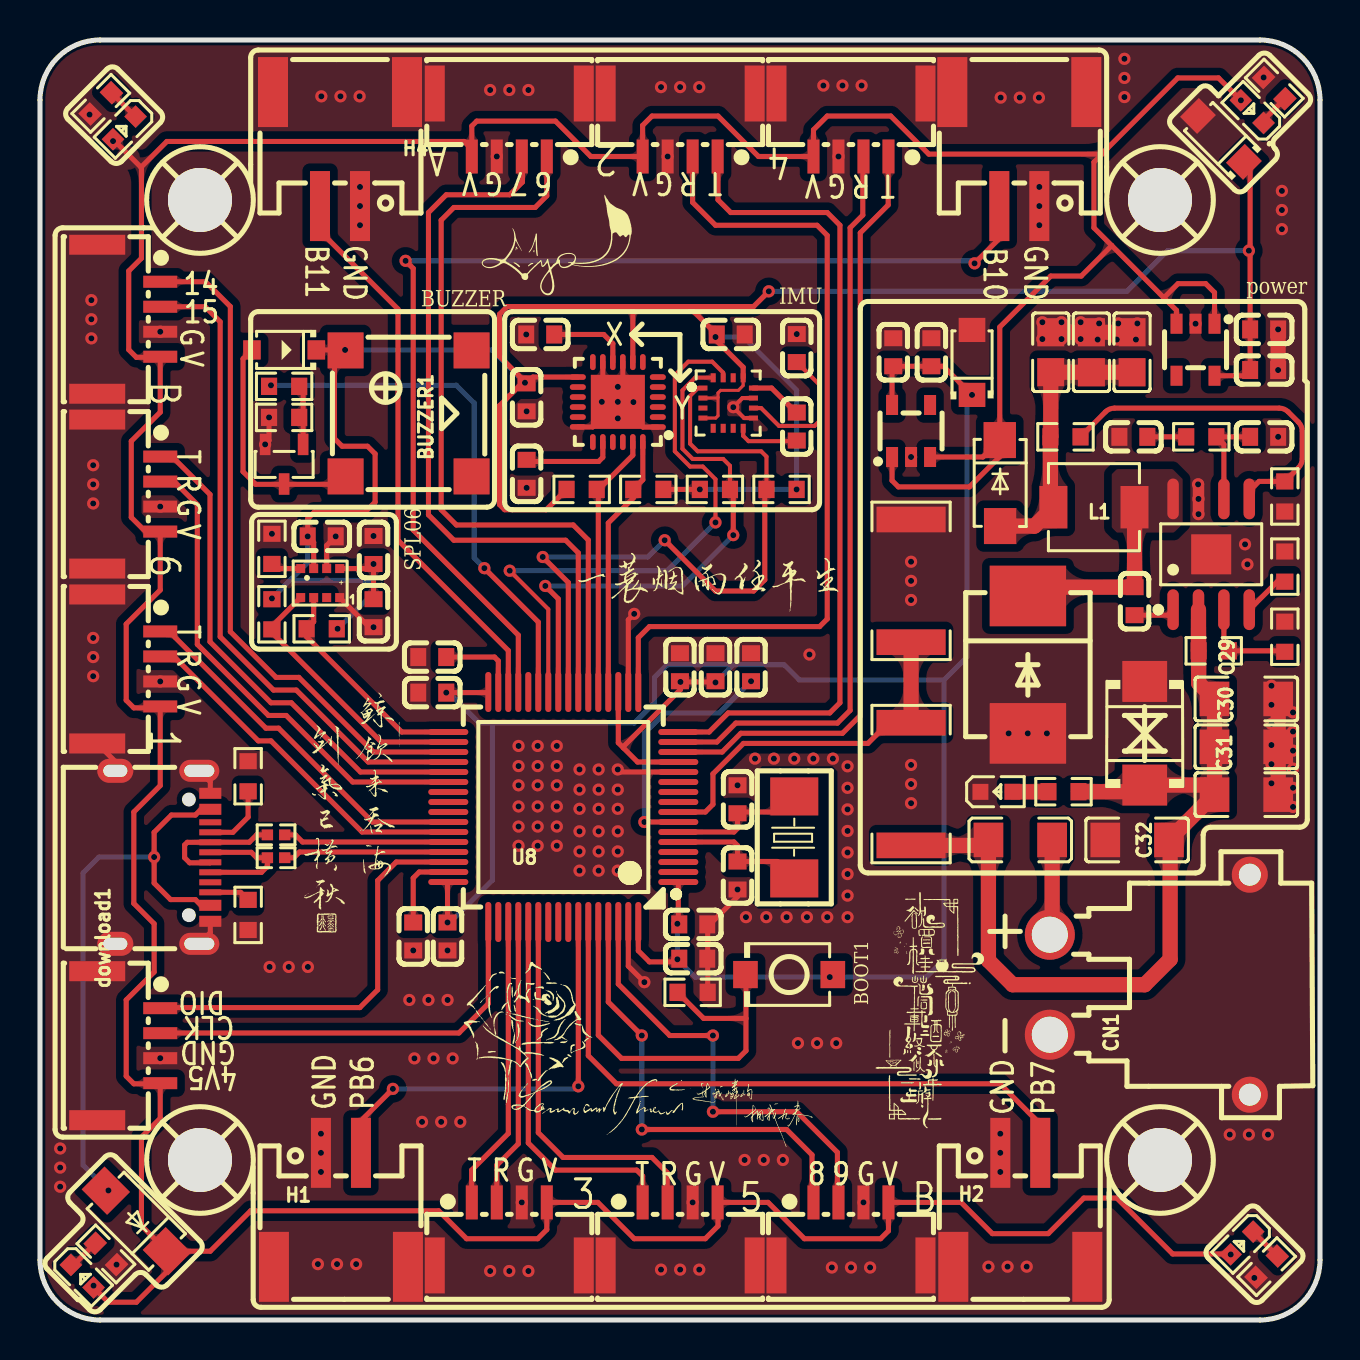
[diagram p1: board, top side]
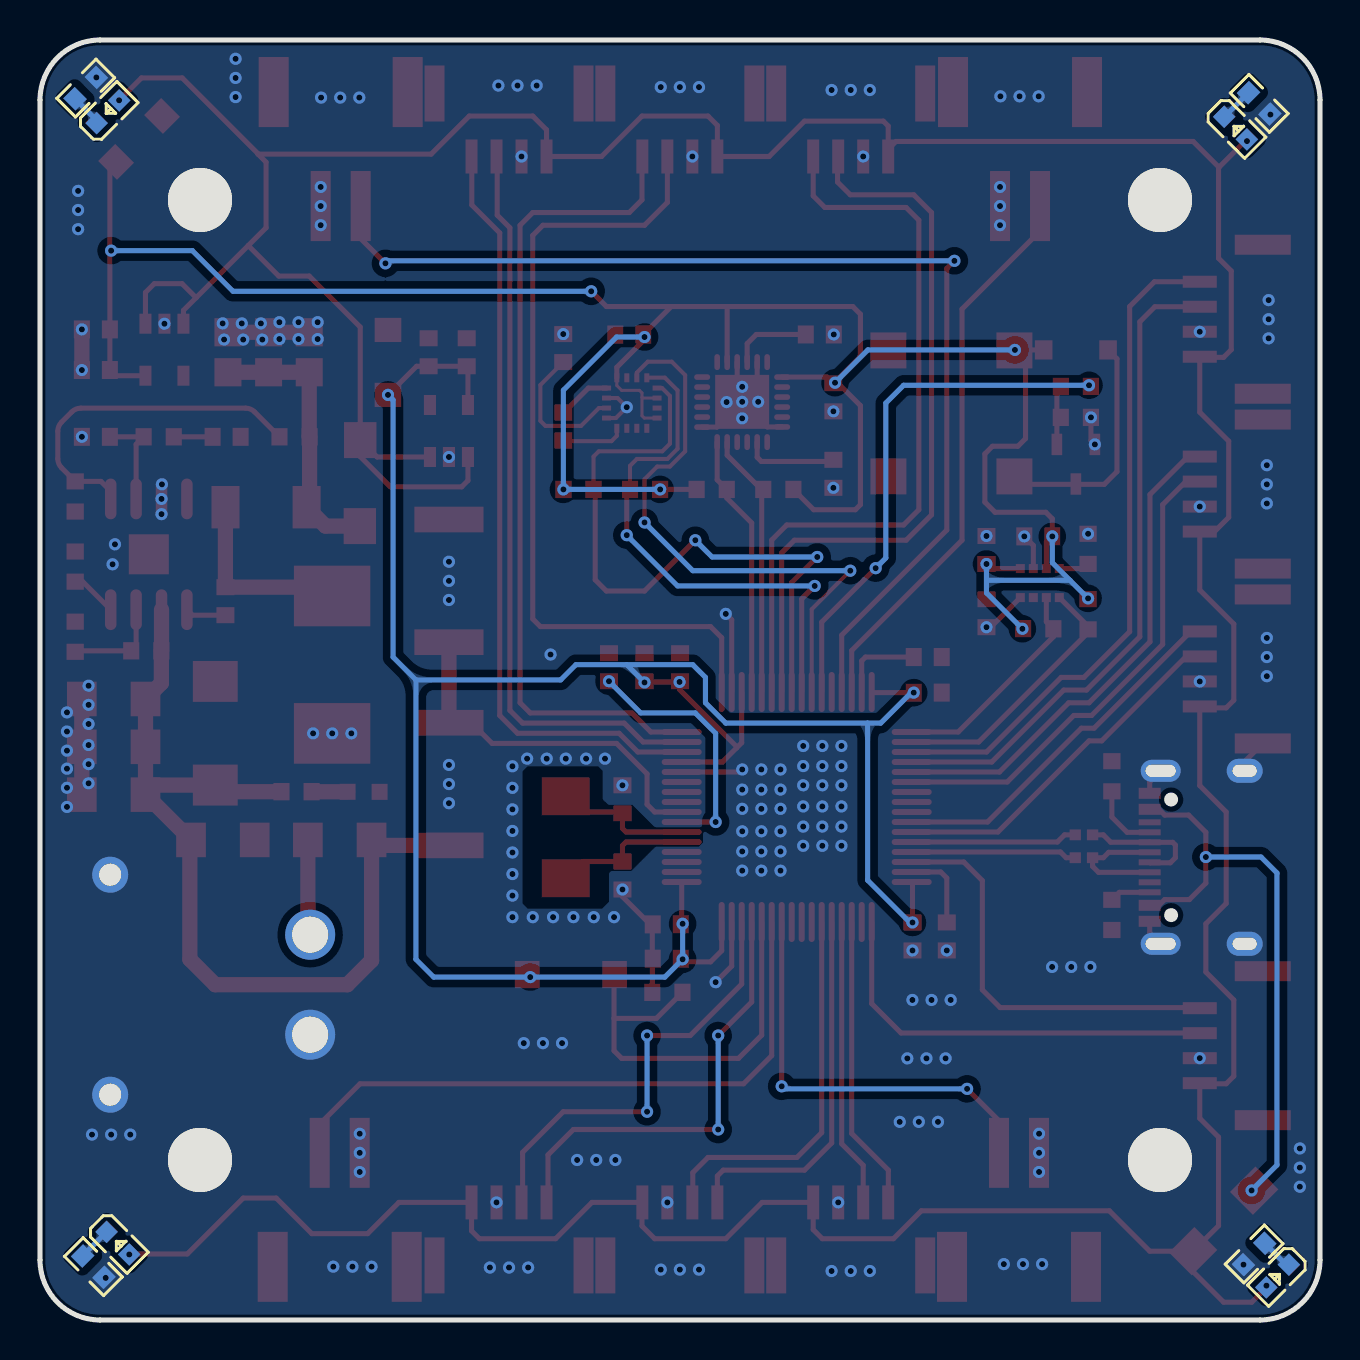
[diagram p2: board, bottom side, seen from below]

Outline 64 x 64 mm; copper layers: Top Layer, Bottom Layer. Coordinates in mm from the lower left corner of the outline.
Outline path: 0,61 arc(0.88,63.12) 3,64 61,64 arc(63.12,63.12) 64,61 64,3 arc(63.12,0.88) 61,0 3,0 arc(0.88,0.88) 0,3 0,61
Stack: Top Layer 0.035mm / Dielectric1 1.51mm FR4 er 4.5 / Bottom Layer 0.035mm

## Design rules (mm)
net OTG_FS_DP: DP2
net OTG_FS_DM: DP2
net $1N209: DP1
net $1N210: DP1
net MCU_OSCI: DP3
net MCU_OSCO: DP3
spacing copperThickness1oz (default): track to track 0.102, other pairs 0.152 to 0.3
spacing copperThickness2oz: track to track 0.203, other pairs 0.152 to 0.3
track width copperThickness1oz (default): min 0.127, default 0.254, max 2.54
track width copperThickness2oz: min 0.203, default 0.254, max 2.54
differential pair differentialPair (default): width min 0.127, default 0.254, max 2.54; gap min 0.152, default 0.152
net GND uses copperRegion
net $1N97 uses copperRegion

## Placement (name value [footprint] x y rotation side)
BOOT1  TS-1088-AR02016  [SW-SMD_L3.9-W3.0-P4.45_1]  37.46 17.27 180 top
BUZZER1  2.731kHz  [BUZ-SMD_4P-L7.5-W7.5-BR_1]  18.43 45.33 180 top
C1  20pF  [C0603]  34.88 26.04 270 top
C2  20pF  [C0603]  34.88 22.23 90 top
C3  2.2uF  [C0603]  19.61 33.15 0 top
C4  2.2uF  [C0603]  18.66 19.18 90 top
C5  100nF  [C0603]  35.55 32.64 270 top
C6  100nF  [C0603]  20.38 19.18 90 top
C7  100nF  [C0603]  32.66 18.07 180 top
C8  100nF  [C0603]  32.66 19.78 180 top
C9  100nF  [C0603]  19.61 31.37 0 top
C10  100nF  [C0603]  32 32.64 270 top
C11  100nF  [C0603]  33.77 32.64 270 top
C12  47uF  [C0805]  50.54 48.39 270 top
C13  100nF  [C0603]  44.57 48.39 90 top
C14  10uF  [C0603]  42.66 48.39 90 top
C15  100nF  [C0603]  14.09 39.18 0 top
C16  100nF  [C0603]  16.68 38.5 90 top
C17  10nF  [C0603]  24.33 46.13 90 top
C18  100nF  [C0603]  25.01 49.28 0 top
C19  100nF  [C0603]  34.54 49.28 0 top
C20  2.2nF  [C0603]  24.33 42.31 270 top
C21  100nF  [C0603]  37.84 44.67 90 top
C22  100nF  [C0603]  61.21 49.53 180 top
C23  47uF  [C0805]  52.57 48.39 270 top
C24  47uF  [C0805]  54.6 48.39 270 top
C25  10uF  [C0603]  61.21 47.5 0 top
C27  100nF  [C0603]  16.68 35.34 90 top
C29  2.2uF  [C1206]  60.32 31.05 180 top
C30  2.2uF  [C1206]  60.32 28.66 180 top
C31  2.2uF  [C1206]  60.32 26.27 180 top
C32  2.2uF  [C1206]  54.86 24 0 top
C33  47pf  [C0603]  61.21 44.16 180 top
C34  4.7nf  [C0603]  54.67 44.16 180 top
C35  0.1uf  [C0603]  54.73 35.94 90 top
C36  100nF  [C0603]  37.84 48.6 270 top
CN1  XT30PW-M30.G.Y  [CONN-TH_XT30PW-M]  55.49 16.76 90 top
D1  1N4148W  [SOD-123_L2.7-W1.6-LS3.7-FD_1]  12.21 48.5 0 top
D2  SMF3.3  [SOD-123FL_L3.0-W1.9-LS3.7-FD]  46.6 47.88 270 top
D3  SS14  [SMA_L4.3-W2.6-LS5.0-FD]  4.82 4.95 315 top
D4  SMBJ15CA  [SMB_L4.6-W3.6-LS5.4-BI]  55.24 29.34 270 top
D5  SS34  [SMA_L4.3-W2.6-LS5.0-FD]  48 41.85 90 top
D6  B560C-13-F  [SMC_L7.1-W6.2-LS8.1-RD]  49.39 32.77 270 top
D7  SMF3.3  [SOD-123FL_L3.0-W1.9-LS3.7-FD]  59.05 59.06 315 top
download1  WAFER-GH1.25-4PWB  [CONN-SMD_4P-P1.25_XUNPU_WAFER-GH1.25-4PWB_1]  4.44 13.72 270 top
download2  WAFER-GH1.25-4PWB  [CONN-SMD_4P-P1.25_XUNPU_WAFER-GH1.25-4PWB_1]  23.46 59.75 180 top
download3  WAFER-GH1.25-4PWB  [CONN-SMD_4P-P1.25_XUNPU_WAFER-GH1.25-4PWB_1]  4.44 50.04 270 top
download4  WAFER-GH1.25-4PWB  [CONN-SMD_4P-P1.25_XUNPU_WAFER-GH1.25-4PWB_1]  40.55 4.31 0 top
H1  WAFER-PH2.0-2PWB  [CONN-SMD_2P-P2.00_XUNPU_WAFER-PH2.0-2PWB_1]  15.05 5.51 0 top
H2  WAFER-PH2.0-2PWB  [CONN-SMD_2P-P2.00_XUNPU_WAFER-PH2.0-2PWB_1]  49.01 5.51 0 top
H3  WAFER-PH2.0-2PWB  [CONN-SMD_2P-P2.00_XUNPU_WAFER-PH2.0-2PWB_1]  48.97 58.55 180 top
H4  WAFER-PH2.0-2PWB  [CONN-SMD_2P-P2.00_XUNPU_WAFER-PH2.0-2PWB_1]  15 58.55 180 top
L1  6.8uH  [IND-SMD_L4.4-W4.2]  52.7 40.64 0 top
LED1  -  [LED_606]  4.18 59.56 225 bottom
LED2  -  [LED_606]  2.15 2.16 315 bottom
LED3  -  [LED_606]  60.57 60.45 135 bottom
LED4  -  [LED_606]  60.06 3.81 225 bottom
LED5  -  [LED_606]  4.18 59.56 225 top
LED6  -  [LED_606]  60.57 60.45 135 top
LED7  -  [LED_606]  60.06 3.81 225 top
LED8  -  [LED_606]  2.15 2.16 315 top
POWER1  -  [LED_604]  47.87 26.42 0 top
Q1  S8050  [SOT-23-3_L2.9-W1.3-P1.90-LS2.3-BR_1]  12.21 42.79 90 top
R1  5.1K  [R0603_5]  61.71 61.6 315 bottom
R2  5.1K  [R0603_5]  3.04 60.83 45 bottom
R3  5.1K  [R0603_5]  3.29 3.3 135 bottom
R4  5.1K  [R0603_5]  61.33 2.67 45 bottom
R5  10K  [R0603]  32.63 16.38 0 top
R6  1K  [R0603]  12.21 46.68 180 top
R7  22  [R0402]  11.8 23.11 0 top
R8  22  [R0402]  11.8 24.26 0 top
R9  5.1K  [R0603]  10.41 27.19 90 top
R10  5.1K  [R0603]  10.41 20.25 270 top
R11  5.1K  [R0603_5]  3.04 60.83 45 top
R12  5.1K  [R0603_5]  61.71 61.6 315 top
R13  5.1K  [R0603_5]  61.33 2.67 45 top
R14  5.1K  [R0603_5]  3.29 3.3 135 top
R15  1kΩ  [R2512]  43.55 36.96 270 top
R16  10K  [R0603]  51.17 26.42 0 top
R17  1kΩ  [R2512]  43.55 26.8 270 top
R18  100K  [R0603]  11.6 38.56 270 top
R19  4.7K  [R0603]  27.08 41.53 180 top
R20  4.7K  [R0603]  30.41 41.53 180 top
R21  10K  [R0603]  12.21 45.13 180 top
R22  243K  [R0603]  62.24 37.67 270 top
R23  90.9K  [R0603]  62.24 34.16 270 top
R24  442K  [R0603]  58.69 33.46 180 top
R25  16.9K  [R0603]  58.06 44.16 0 top
R26  10K  [R0603]  14.09 34.56 0 top
R27  10K  [R0603]  11.6 35.29 90 top
R28  10K  [R0603]  37.08 41.53 0 top
R29  10K  [R0603]  33.75 41.53 180 top
RHS1  85K  [R0603]  51.27 44.16 180 top
RLS1  16K  [R0603]  62.24 41.18 90 top
SCREW1  -  [M3螺丝_2]  56 56 180 top
SCREW2  -  [M3螺丝_2]  8 56 180 top
SCREW3  -  [M3螺丝_2]  8 8 180 top
SCREW4  -  [M3螺丝_2]  56 8 180 top
U1  ME6217C33M5G  [SOT-23-5_L3.0-W1.7-P0.95-LS2.8-BR]  43.55 44.45 270 top
U2  1206L300SL16ARG  [L1206]  49.01 24 180 top
U3  SPL06-001  [SENSOR-SMD_SPL06-001]  14.01 36.85 0 top
U4  MPU-6050  [QFN-24_L4.0-W4.0-P0.50-BL-EP2.7]  28.89 45.9 90 top
U5  QMC5883L-TR  [LGA-16_L3.0-W3.0-P0.50-BL_SQ]  34.41 45.85 270 top
U6  ME6217C33M5G  [SOT-23-5_L3.0-W1.7-P0.95-LS2.8-BR]  57.78 48.51 90 top
U7  TPS54560DDAR  [SOIC-8_L5.0-W4.0-P1.27-LS6.0-BL-EP2.0]  58.56 38.28 0 top
U8  STM32F405RGT6  [LQFP-64_L10.0-W10.0-P0.50-LS12.0-BL_1]  26.17 25.65 90 top
uart1  WAFER-GH1.25-4PWB  [CONN-SMD_4P-P1.25_XUNPU_WAFER-GH1.25-4PWB_1]  40.55 59.75 180 top
uart2  WAFER-GH1.25-4PWB  [CONN-SMD_4P-P1.25_XUNPU_WAFER-GH1.25-4PWB_1]  4.44 32.55 270 top
uart3  WAFER-GH1.25-4PWB  [CONN-SMD_4P-P1.25_XUNPU_WAFER-GH1.25-4PWB_1]  32.01 59.75 180 top
uart4  WAFER-GH1.25-4PWB  [CONN-SMD_4P-P1.25_XUNPU_WAFER-GH1.25-4PWB_1]  32.01 4.31 0 top
uart5  WAFER-GH1.25-4PWB  [CONN-SMD_4P-P1.25_XUNPU_WAFER-GH1.25-4PWB_1]  23.47 4.31 0 top
uart6  WAFER-GH1.25-4PWB  [CONN-SMD_4P-P1.25_XUNPU_WAFER-GH1.25-4PWB_1]  4.44 41.3 270 top
USB1  TYPE-C 16PIN 2MD(073)  [USB-C-SMD_TYPE-C-6PIN-2MD-073_2]  6.14 23.13 270 top
X1  8MHz  [OSC-SMD_L5.0-W3.2_1]  37.71 24.13 270 top

## Footprints (pads in the part's own frame, mm; a bottom-side part is the same pattern mirrored in y, then rotated)
BUZ-SMD_4P-L7.5-W7.5-BR_1
  rect 1.8x1.8 smd: 1(3.15,-3.15) 2(3.15,3.15) 3(-3.15,3.15) 4(-3.15,-3.15)
C0603
  rect 0.8x0.9 smd: 1(-0.7,0) 2(0.7,0)
C0805
  rect 1.41x1.35 smd: 1(-1,0) 2(1,0)
C1206
  rect 1.485x1.728 smd: 1(-1.593,0) 2(1.593,0)
CONN-SMD_2P-P2.00_XUNPU_WAFER-PH2.0-2PWB_1
  rect 1x3.5 smd: 1(-1,2.85) 2(1,2.85)
  rect 1.5x3.5 smd: 3(-3.35,-2.85) 4(3.35,-2.85)
CONN-SMD_4P-P1.25_XUNPU_WAFER-GH1.25-4PWB_1
  rect 0.6x1.7 smd: 1(-1.875,1.575) 2(-0.625,1.575) 3(0.625,1.575) 4(1.875,1.575)
  rect 1x2.8 smd: 5(3.725,-1.575) 6(-3.725,-1.575)
CONN-TH_XT30PW-M
  round 2.5 hole 1.8: 1(-2.5,5) 2(2.5,5)
  round 1.8 hole 1.1: 3(5.5,-5) 4(-5.5,-5)
IND-SMD_L4.4-W4.2
  rect 1.4x2.12 smd: 1(2.028,0) 2(-2.028,0)
L1206
  rect 1.485x1.728 smd: 1(-1.593,0) 2(1.593,0)
LED_604
  rect 0.8x0.8 smd: 1(-0.851,-0.01) 2(0.75,-0.005)
LED_606
  rect 0.8x0.8 smd: 1(-0.851,-0.01) 2(0.75,-0.005)
LGA-16_L3.0-W3.0-P0.50-BL_SQ
  rect 0.25x0.45 smd: 1(-0.75,-1.263) 2(-0.25,-1.263) 3(0.25,-1.263) 4(0.75,-1.263) 9(0.75,1.263) 10(0.25,1.263) 11(-0.25,1.263) 12(-0.75,1.263)
  rect 0.45x0.25 smd: 5(1.263,-0.75) 6(1.263,-0.25) 7(1.263,0.25) 8(1.263,0.75) 13(-1.263,0.75) 14(-1.263,0.25) 15(-1.263,-0.25) 16(-1.263,-0.75)
LQFP-64_L10.0-W10.0-P0.50-LS12.0-BL_1
  oval 0.3x2 smd: 1(-3.75,-5.75) 2(-3.25,-5.75) 3(-2.75,-5.75) 4(-2.25,-5.75) 5(-1.75,-5.75) 6(-1.25,-5.75) 7(-0.75,-5.75) 8(-0.25,-5.75) 9(0.25,-5.75) 10(0.75,-5.75) 11(1.25,-5.75) 12(1.75,-5.75) 13(2.25,-5.75) 14(2.75,-5.75) 15(3.25,-5.75) 16(3.75,-5.75) 33(3.75,5.75) 34(3.25,5.75) 35(2.75,5.75) 36(2.25,5.75) 37(1.75,5.75) 38(1.25,5.75) 39(0.75,5.75) 40(0.25,5.75) 41(-0.25,5.75) 42(-0.75,5.75) 43(-1.25,5.75) 44(-1.75,5.75) 45(-2.25,5.75) 46(-2.75,5.75) 47(-3.25,5.75) 48(-3.75,5.75)
  oval 2x0.3 smd: 17(5.75,-3.75) 18(5.75,-3.25) 19(5.75,-2.75) 20(5.75,-2.25) 21(5.75,-1.75) 22(5.75,-1.25) 23(5.75,-0.75) 24(5.75,-0.25) 25(5.75,0.25) 26(5.75,0.75) 27(5.75,1.25) 28(5.75,1.75) 29(5.75,2.25) 30(5.75,2.75) 31(5.75,3.25) 32(5.75,3.75) 49(-5.75,3.75) 50(-5.75,3.25) 51(-5.75,2.75) 52(-5.75,2.25) 53(-5.75,1.75) 54(-5.75,1.25) 55(-5.75,0.75) 56(-5.75,0.25) 57(-5.75,-0.25) 58(-5.75,-0.75) 59(-5.75,-1.25) 60(-5.75,-1.75) 61(-5.75,-2.25) 62(-5.75,-2.75) 63(-5.75,-3.25) 64(-5.75,-3.75)
M3螺丝_2
  round 3.2 hole 3.2: 1(0,0)
OSC-SMD_L5.0-W3.2_1
  rect 1.9x2.4 smd: 1(-2.05,0) 2(2.05,0)
QFN-24_L4.0-W4.0-P0.50-BL-EP2.7
  oval 0.28x0.8 smd: 1(-1.25,-2) 2(-0.75,-2) 3(-0.25,-2) 4(0.25,-2) 5(0.75,-2) 6(1.25,-2) 13(1.25,2) 14(0.75,2) 15(0.25,2) 16(-0.25,2) 17(-0.75,2) 18(-1.242,2)
  oval 0.8x0.28 smd: 7(2,-1.25) 8(2,-0.75) 9(2,-0.25) 10(2,0.25) 11(2,0.75) 12(2,1.25) 19(-2,1.25) 20(-2,0.75) 21(-2,0.25) 22(-2,-0.25) 23(-2,-0.75) 24(-2,-1.25)
  rect 2.7x2.7 smd: 25(0.013,0)
R0402
  rect 0.566x0.54 smd: 1(-0.433,0) 2(0.433,0)
R0603
  rect 0.806x0.864 smd: 1(-0.753,0) 2(0.753,0)
R0603_5
  rect 0.806x0.864 smd: 1(-0.753,0) 2(0.753,0)
R2512
  rect 1.282x3.456 smd: 1(-3.067,0) 2(3.067,0)
SENSOR-SMD_SPL06-001
  rect 0.45x0.45 smd: 1(0.975,-0.725) 2(0.325,-0.725) 3(-0.325,-0.725) 4(-0.975,-0.725) 5(-0.975,0.725) 6(-0.325,0.725) 7(0.325,0.725) 8(0.975,0.725)
SMA_L4.3-W2.6-LS5.0-FD
  rect 1.8x1.62 smd: 1(-2.15,-0.009) 2(2.15,0.009)
SMB_L4.6-W3.6-LS5.4-BI
  rect 2.047x2.241 smd: 1(-2.591,0) 2(2.591,0)
SMC_L7.1-W6.2-LS8.1-RD
  rect 3.03x3.82 smd: 1(-3.435,0) 2(3.435,0)
SOD-123_L2.7-W1.6-LS3.7-FD_1
  rect 0.88x0.96 smd: 1(-1.61,0) 2(1.61,0)
SOD-123FL_L3.0-W1.9-LS3.7-FD
  rect 1.208x1.33 smd: 1(-1.624,0) 2(1.624,0)
SOIC-8_L5.0-W4.0-P1.27-LS6.0-BL-EP2.0
  oval 0.574x2.038 smd: 1(-1.905,-2.769) 2(-0.635,-2.769) 3(0.635,-2.769) 4(1.905,-2.769) 5(1.905,2.769) 6(0.635,2.769) 7(-0.635,2.769) 8(-1.905,2.769)
  rect 2x2 smd: 9(0,0)
SOT-23-3_L2.9-W1.3-P1.90-LS2.3-BR_1
  rect 1.07x0.532 smd: 1(0.99,-0.95) 2(0.99,0.95) 3(-0.99,0)
SOT-23-5_L3.0-W1.7-P0.95-LS2.8-BR
  rect 1x0.6 smd: 1(1.3,-0.95) 2(1.3,0) 3(1.3,0.95) 4(-1.3,0.95) 5(-1.3,-0.95)
SW-SMD_L3.9-W3.0-P4.45_1
  rect 1.23x1.36 smd: 1(-2.185,0) 2(2.185,0)
USB-C-SMD_TYPE-C-6PIN-2MD-073_2
  rect 0.55x1.1 smd: 1(-3.2,2.375) 2(-2.4,2.375) 11(2.4,2.375) 12(3.2,2.375)
  rect 0.3x1.1 smd: 3(-1.75,2.375) 4(-1.25,2.375) 5(-0.75,2.375) 6(-0.25,2.375) 7(0.25,2.375) 8(0.75,2.375) 9(1.25,2.375) 10(1.75,2.375)
  oval 1.1x2 hole 0.6x1.5: 13(-4.325,1.825) 14(4.325,1.825)
  oval 1.2x1.8 hole 0.6x1.2: 13(-4.325,-2.375) 14(4.325,-2.375)

## Nets
As in the schematic.

Pads without a net: BUZZER1 3 4; U1 4; U3 2; U4 2 3 4 5 6 7 12 14 15 16 17 19 21 22; U5 3 5 6 7 14; U6 4; U8 2 3 4 9 10 11 28 39 40 41 50 55 56 57; USB1 3 9

## Via types
v1: diameter 0.61, hole 0.305, Top Layer to Bottom Layer, 258 vias

## Routing (per net, layer and track width the routed paths; a pad name or vN(x,y) marks a point on that pad's centre or on a via; arc(x,y) is an arc through that point)
4V5: length 239.6
  Top Layer w0.254: 21.59,58.54 21.59,59.7 21.84,59.94 25.77,59.94 27.54,58.18 uart3.4 30.13,59.73 30.6,60.2 33.9,60.2 35.92,58.18 uart1.4 38.67,59.51 39.36,60.2 42.54,60.2 44.44,58.29 53.1,58.29 ; 21.59,58.54 21.2,58.93 6.34,58.93 5.05,57.64 ; 21.59,58.54 download2.4 ; D3.2 5.07,4.71 5.07,9.14 6.01,10.08 download1.4 5.98,11.81 4.69,11.81 4.31,12.19 4.31,16 5.71,17.4 5.71,19.81 4.69,20.83 4.69,25.4 6.01,26.72 uart2.4 5.94,30.61 4.69,30.61 4.31,30.99 4.31,34.8 6.01,36.5 uart6.4 5.96,39.37 5.33,39.37 4.56,40.13 4.56,43.94 6.01,45.39 download3.4 5.98,48.13 4.82,48.13 4.44,48.51 4.44,52.45 5.07,53.09 5.07,57.61 5.05,57.64 ; D3.2 8.51,3.44 10.53,5.46 19.93,5.46 21.33,4.06 24.88,4.06 25.34,4.52 uart5.4 27.89,5.88 29.71,4.06 33.27,4.06 33.9,4.7 33.9,5.86 uart4.4 36.4,5.88 38.22,4.06 42.03,4.06 42.42,4.46 download4.4 46.05,5.88 47.62,4.32 50.41,4.32 52.19,6.1 53.84,6.1 56.63,3.3 59.51,3.3 LED7.2 ; D3.2 6.34,2.42 4.82,0.89 3.41,0.89 2.68,1.63 ; 53.1,58.29 53.1,58.31 56.89,62.1 58.93,62.1 v1(60.05,60.99) ; 53.1,58.29 52.7,57.89 52.7,54.61 53.59,53.72 ; LED5.2 5.05,57.64 ; U1.3 47.14,43.15 D5.2 ; 53.59,53.72 52.06,52.2 50.54,52.2 47.99,49.65 D5.2 ; 53.59,53.72 56.2,51.11 ; D5.2 47.99,43.17 46.47,41.66 42.92,41.66 42.6,41.97 U1.1 ; 56.2,51.11 56.9,51.82 58.29,51.82 58.73,51.37 58.73,49.81 ; 56.2,51.11 56.83,50.48 U6.3
  vias: v1(2.68,1.72) v1(3.65,58.95) v1(59.54,3.28)
5V_USB: length 29.4
  Top Layer w0.254: USB1.11 8.05,20.73 7.77,21.02 6.53,21.02 5.71,21.84 v1(5.71,23.15) 5.71,24.38 6.57,25.25 7.77,25.25 8.05,25.53 USB1.2
  Bottom Layer w0.254: v1(5.71,23.15) 2.95,23.15 2.15,22.35 2.15,7.75 v1(3.42,6.48)
12VIN: length 46
  Top Layer w0.762: R16.2 54.91,26.42 D4.2 58.25,26.75 C31.2 ; C31.2 58.71,26.27 C32.2 56.51,23.94 56.51,18.03 55.24,16.76 48.63,16.76 47.42,17.98 U2.2 47.15,23.73 R17.2 ; C31.2 C30.2 C29.2 57.93,31.84 R24.2 57.92,33.47 U7.2
GND: length 49
  Top Layer w0.203: U5.11 35.12,46.1 v1(34.66,45.64) 35.21,45.1 U5.9
  Top Layer w0.254: v1(28.89,45.91) 27.64,44.65 U4.18 ; v1(28.89,45.91) 30.15,44.65 U4.1 ; v1(28.89,45.91) 29.14,46.16 U4.9 ; v1(28.89,45.91) 28.14,46.66 U4.11 ; U8.18 29.42,35.01 v1(29.71,35.31) ; v1(16.68,34.64) 16.47,34.64 U3.1 ; v1(30.22,16.89) 29.42,17.69 U8.63 ; uart2.5 3.77,27.92 USB1.13 ; USB1.1 8.52,26.91 USB1.13 ; v1(34.88,21.53) 34.88,21.17 33.49,19.78 33.36,19.78 33.38,19.76 R5.2 ; v1(11.45,45.13) 11.45,43.98 v1(11.26,43.78) ; v1(28.89,27.53) 29.01,27.4 U8.12 ; U3.7 14.33,38.73 v1(14.79,39.18) ; USB1.12 8.52,19.36 USB1.14
  Top Layer w0.762: C12.1 C23.1 C24.1 ; C31.1 C30.1 C29.1 ; v1(61.91,47.5) v1(61.91,49.53)
  vias: v1(1.01,8.58) v1(1.01,7.62) v1(1.01,6.66) v1(2.48,60.27) v1(2.57,50.99) v1(2.57,50.04) v1(2.57,49.08) v1(2.66,42.74) v1(2.66,41.78) v1(2.66,40.83) v1(2.66,34.1) v1(2.66,33.15) v1(2.66,32.19) v1(3.83,2.77) v1(6.01,49.41) v1(6.01,40.67) v1(6.01,31.93) v1(6.01,13.09) v1(11.48,17.65) v1(11.6,39.31) v1(12.44,17.65) v1(13.39,17.65) v1(13.89,2.79) v1(14.07,61.18) v1(14.05,9.31) v1(14.05,8.36) v1(14.05,7.4) v1(14.85,2.79) v1(15.02,61.18) v1(15.81,2.79) v1(15.98,61.18) v1(16,56.65) v1(16,55.7) v1(16,54.74) v1(16.68,39.2) v1(18.47,16) v1(18.66,18.48) v1(18.72,13.08) v1(19.1,9.91) v1(19.42,16) v1(19.68,13.08) v1(20.06,9.91) v1(20.38,18.48) v1(20.38,16) v1(20.63,13.08) v1(21.01,9.91) v1(22.51,61.5) v1(22.51,2.45) v1(22.84,58.18) v1(23.46,61.5) v1(23.46,2.45) v1(23.93,28.7) v1(23.93,27.7) v1(23.93,26.74) v1(23.93,25.68) v1(23.93,24.67) v1(23.93,23.71) v1(24.09,5.88) v1(24.31,49.28) v1(24.33,45.43) v1(24.33,41.61) v1(24.42,61.5) v1(24.42,2.45) v1(24.88,28.7) v1(24.88,27.7) v1(24.88,26.74) v1(24.88,25.68) v1(24.88,24.67) v1(24.88,23.71) v1(25.84,28.7) v1(25.84,27.7) v1(25.84,26.74) v1(25.84,25.68) v1(25.84,24.67) v1(25.84,23.71) v1(26.98,27.53) v1(26.98,26.52) v1(26.98,25.56) v1(26.98,24.43) v1(26.98,23.43) v1(26.98,22.47) v1(27.93,27.53) v1(27.93,26.52) v1(27.93,25.56) v1(27.93,24.43) v1(27.93,23.43) v1(27.93,22.47) v1(28.09,45.91) v1(28.89,46.66) v1(28.89,45.08) v1(28.89,26.52) v1(28.89,25.56) v1(28.89,24.43) v1(28.89,23.43) v1(28.89,22.47) v1(29.67,45.9) v1(31.05,61.65) v1(31.05,2.52) v1(31.38,58.18) v1(32.01,61.65) v1(32.01,2.52) v1(32.63,5.88) v1(32.96,61.65) v1(32.96,2.52) v1(34.88,26.74) v1(35.23,8) v1(35.3,20.14) v1(35.75,28.07) v1(36.19,8) v1(36.31,20.14) v1(36.7,28.07) v1(37.14,8) v1(37.33,20.14) v1(37.71,28.07) v1(37.84,49.3) v1(37.9,13.84) v1(38.35,20.14) v1(38.47,33.27) v1(38.67,28.07) v1(38.85,13.84) v1(39.17,61.72) v1(39.36,20.14) v1(39.59,2.62) v1(39.64,28.07) v1(39.81,13.84) v1(39.92,58.18) v1(40.12,61.72) v1(40.38,27.69) v1(40.38,26.61) v1(40.38,25.53) v1(40.38,24.45) v1(40.38,23.38) v1(40.38,22.3) v1(40.38,21.22) v1(40.38,20.14) v1(40.55,2.62) v1(41.08,61.72) v1(41.17,5.88) v1(41.51,2.62) v1(43.55,43.15) v1(43.55,37.91) v1(43.55,36.96) v1(43.55,36) v1(43.55,27.75) v1(43.55,26.8) v1(43.55,25.84) v1(47.42,2.67) v1(48.03,61.12) v1(48.01,9.31) v1(48.01,8.36) v1(48.01,7.4) v1(48.43,29.33) v1(48.38,2.67) v1(48.99,61.12) v1(49.34,2.67) v1(49.39,29.33) v1(49.95,61.12) v1(49.97,56.65) v1(49.97,55.7) v1(49.97,54.74) v1(50.12,49.89) v1(50.12,49.05) v1(50.35,29.33) v1(51.08,49.89) v1(51.07,49.05) v1(52.03,49.89) v1(52.03,49.05) v1(52.88,49.02) v1(52.96,49.83) v1(53.84,49.02) v1(53.91,49.83) v1(54.22,63.06) v1(54.22,62.1) v1(54.22,61.15) v1(54.8,49.02) v1(54.87,49.83) v1(57.78,49.81) v1(57.9,41.78) v1(57.92,41.05) v1(57.92,40.29) v1(59.49,9.27) v1(60.25,38.78) v1(60.37,37.78) v1(60.44,9.27) v1(60.72,2.11) v1(61.18,62.13) v1(61.4,9.27) v1(61.57,31.71) v1(61.57,30.76) v1(61.57,29.8) v1(61.57,28.75) v1(61.57,27.79) v1(61.57,26.84) v1(61.91,44.16) v1(62.1,56.46) v1(62.1,55.5) v1(62.1,54.54) v1(62.65,30.38) v1(62.65,29.42) v1(62.65,28.47) v1(62.65,27.57) v1(62.65,26.61) v1(62.65,25.65)
VBAT: length 13.9
  Top Layer w0.762: D5.1 49.72,39.7 50.67,40.64 50.52,40.79 RHS1.2 50.54,44.18 C12.2 C23.2 C24.2
VDD_MCU: length 113.4
  Top Layer w0.254: 29.17,28.61 28.92,28.86 U8.19 ; 29.17,28.61 29.88,27.9 U8.13 ; 29.17,28.61 29.17,28.67 32.02,31.52 v1(32.02,31.9) 33.75,31.9 v1(33.77,31.88) ; U8.32 22.38,31.37 v1(20.31,31.37) ; U8.48 20.38,21.86 v1(20.38,19.88) ; 31.96,18.07 31.8,17.91 30.47,17.91 29.92,18.46 U8.64 ; 31.96,19.78 31.92,19.83 U8.1 ; U1.5 42.6,47.63 C14.1 C13.1 45.17,47.69 v1(46.6,46.26)
  Bottom Layer w0.254: 22.62,29.85 29.71,29.85 30.73,30.86 30.73,32.13 31.36,32.77 34.66,32.77 ; 22.62,29.85 22.62,21.99 20.51,19.88 v1(20.38,19.88) ; 22.62,29.85 21.96,29.85 20.44,31.37 v1(20.31,31.37) ; v1(31.87,19.81) v1(31.87,18.03) 32.76,17.15 v1(39.49,17.15) 44.32,17.15 45.2,18.03 45.2,32 ; 34.66,32.77 v1(33.77,31.88) ; 34.66,32.77 37.2,32.77 37.97,32 45.2,32 ; 45.2,32 46.35,33.15 46.35,46 v1(46.6,46.26)
VDD_SENS: length 139.8
  Top Layer w0.152: 33.9,46.13 33.9,46.36 34.03,46.48 34.92,46.48 35.16,46.72 U5.13 ; 33.9,46.13 33.87,46.1 U5.2 ; 33.9,46.13 33.9,45.21 33.79,45.1 U5.4
  Top Layer w0.254: U4.8 29.64,50.66 29.65,50.67 ; 58.73,47.21 60.22,47.21 C25.1 C22.2 60.51,57.6 D7.2 ; C27.2 v1(16.68,37.8) 16.45,37.57 U3.8 ; R19.2 25.31,40.51 23.23,40.51 22.98,40.77 22.98,45.72 24.09,46.83 C17.2 ; U4.13 24.64,47.15 C17.2 ; C17.2 22.98,48.18 22.98,50.29 23.36,50.67 29.65,50.67 ; U3.6 13.68,38.88 v1(13.39,39.18) 13.39,40.06 13.71,40.39 16.25,40.39 16.76,40.89 16.76,43.31 16.38,43.69 15.11,43.69 14.72,44.07 14.72,47.92 BUZZER1.1 v1(15.25,48.5) D1.2 ; 29.65,50.67 32.44,50.67 ; v1(36.44,51.44) 35.68,50.67 32.44,50.67 ; 32.44,50.67 C19.1 33.84,48.96 35.16,47.64 U5.13 ; R20.1 v1(32.99,41.53)
  Bottom Layer w0.254: v1(13.39,39.18) 13.39,37.87 12.5,36.99 ; v1(60.44,53.47) 56.38,53.47 54.35,51.44 v1(36.44,51.44) ; 16.68,37.06 16.6,36.99 12.5,36.99 ; 16.68,37.06 16.68,36.36 v1(14.88,34.56) ; 16.68,37.06 v1(16.68,37.8) ; v1(33.77,49.15) 35.17,49.15 37.83,46.49 v1(37.83,41.53) v1(32.99,41.53) ; v1(11.6,36.08) 12.5,36.99 ; v1(24.25,46.86) 22.61,48.5 v1(15.25,48.5)
BOOT: length 21.5
  Top Layer w0.254: 35.3,15.08 33.18,15.08 R5.1 ; 35.3,15.08 35.3,13.46 34.92,13.08 29.08,13.08 27.92,14.24 U8.60 ; 35.3,15.08 35.3,17.25 BOOT1.2
BUZZER: length 26.3
  Top Layer w0.254: v1(22.22,37.59) 24.92,34.89 U8.27
  Bottom Layer w0.254: v1(22.22,37.59) 21.71,38.1 21.71,45.85 20.82,46.74 v1(11.55,46.74)
FB: length 17.4
  Top Layer w0.254: RHS1.1 53.27,45.41 arc(53.48,45.54) 53.72,45.59 61.96,45.59 arc(62.2,45.54) 62.41,45.41 62.92,44.89 arc(63.06,44.68) 63.11,44.44 63.11,43.06 arc(63.06,42.82) 62.92,42.61 RLS1.2 60.95,41.93 60.46,41.44 U7.5
I2C1_SCL: length 13.4
  Top Layer w0.254: U8.34 17.07,28.9 11.6,34.37 R27.1 11.6,34.68 U3.4
I2C1_SDA: length 11.2
  Top Layer w0.254: U3.3 13.68,34.91 R26.1 13.33,34.16 18.09,29.4 U8.33
MCU_OSCI: length 7
  Top Layer w0.254: U8.5 34.7,23.9 34.88,23.72 C2.2 36.87,22.93 X1.2
MCU_OSCO: length 7
  Top Layer w0.254: X1.1 36.93,25.4 34.94,25.4 C1.2 34.88,24.58 34.7,24.4 U8.6
NRST: length 12.5
  Top Layer w0.254: U8.7 v1(30.22,24.9)
  Bottom Layer w0.254: v1(30.22,24.9) 30.22,29.34 31.23,30.35 33.97,30.35 v1(35.55,31.94)
OTG_FS_DM: length 6.4
  Top Layer w0.254: R8.1 10.83,24.26 10.47,23.89 8.52,23.89 USB1.5 7.37,23.88 7.23,23.75 7.23,23.11 7.48,22.86 8.49,22.86 USB1.7
OTG_FS_DP: length 6.4
  Top Layer w0.254: USB1.8 11.07,22.38 11.37,22.68 R7.1 10.83,23.11 10.56,23.38 USB1.6
PA6: length 37.8
  Top Layer w0.254: download2.1 25.34,56.21 24.76,55.63 20.69,55.63 20.06,54.99 20.06,40.51 20.82,39.75 26.66,39.75 27.42,39 U8.22
PA7: length 37
  Top Layer w0.254: download2.2 24.12,58.14 24.12,56.9 23.49,56.26 20.31,56.26 19.42,55.37 19.42,40.26 20.69,38.99 26.28,38.99 26.92,38.36 U8.23
PB0: length 29.9
  Top Layer w0.203: U5.15 34.16,47.37 33.61,47.92 32.41,47.92 31.74,47.24 31.74,43.43 32.5,42.67 33.14,42.67 33.77,42.04 v1(33.77,39.88) ; v1(23.49,37.47) 25.42,35.54 U8.26
  Bottom Layer w0.254: v1(23.49,37.47) 31.36,37.47 v1(33.77,39.88)
PB8: length 22.5
  Top Layer w0.254: v1(30.09,14.22) 28.42,15.9 U8.61 ; download4.1 38.6,5.95 38.6,8.26 37.33,9.53 v1(30.09,9.53)
  Bottom Layer w0.254: v1(30.09,14.22) v1(30.09,9.53)
PB9: length 22.3
  Top Layer w0.254: v1(33.65,14.22) 31.49,14.22 28.92,16.8 U8.62 ; download4.2 39.87,5.93 39.87,8.38 37.84,10.41 v1(33.65,10.41)
  Bottom Layer w0.254: v1(33.65,14.22) v1(33.65,10.41)
PB14: length 33.7
  Top Layer w0.254: U8.35 16.67,28.4 12.94,32.13 11.8,32.13 9.52,34.42 9.52,50.67 8.28,51.91 download3.1
PB15: length 33.1
  Top Layer w0.254: download3.2 8.26,50.66 9.01,49.91 9.01,34.16 11.68,31.5 12.81,31.5 16.41,27.9 U8.36
PC4: length 33.5
  Top Layer w0.203: U5.1 32.9,46.6 32.5,46.2 32.5,43.82 32.89,43.43 36.06,43.43 36.32,43.17 R28.1
  Top Layer w0.254: v1(25.14,38.15) 26.42,36.87 U8.24 ; v1(31.23,38.99) 33.77,36.45 35.68,36.45 36.24,37.01 36.24,41.45 R28.1
  Bottom Layer w0.254: v1(25.14,38.15) 30.4,38.15 v1(31.23,38.99)
PC5: length 27
  Top Layer w0.203: U5.16 33.65,47.12 32.76,47.12 32.12,46.48 32.12,43.56 32.63,43.05 34.16,43.05 34.5,42.71 R29.1
  Top Layer w0.254: v1(25.27,36.7) 25.92,36.05 U8.25 ; R29.1 34.66,41.37 v1(34.66,39.24)
  Bottom Layer w0.254: v1(25.27,36.7) 32.12,36.7 v1(34.66,39.24)
PWM_1: length 21.4
  Top Layer w0.254: v1(17.64,11.56) 16.05,9.96 H1.2 ; U8.58 v1(26.92,11.68)
  Bottom Layer w0.254: v1(26.92,11.68) 26.79,11.56 v1(17.64,11.56)
PWM_2: length 32.1
  Top Layer w0.254: U8.59 27.42,13.22 28.82,11.81 48,11.81 50.01,9.8 H2.2
PWM_3: length 55.8
  Top Layer w0.254: H3.2 47.97,54.07 v1(46.73,52.83) ; v1(18.28,52.96) 18.66,52.58 18.66,39.5 23.92,34.24 U8.29
  Bottom Layer w0.254: v1(46.73,52.83) 46.6,52.96 v1(18.28,52.96)
PWM_4: length 28.2
  Top Layer w0.254: H4.2 14,54.45 17.9,50.55 17.9,38.99 23.42,33.47 U8.30
SCL2: length 13.3
  Top Layer w0.254: U4.23 29.64,43.24 27.93,41.53 R19.1 27.92,41.45 U8.21
SDA2: length 13.2
  Top Layer w0.254: U4.24 30.14,42.01 R20.2 29.66,41.1 28.42,39.85 U8.20
SENS_VOL: length 18.4
  Top Layer w0.254: U8.8 33.27,25.4 33.65,25.78 33.65,27.31 35.17,28.83 41.39,28.83 42.43,29.86 R17.1
  Top Layer w0.762: R17.1 R15.2
SWCLK: length 21.1
  Top Layer w0.254: U8.49 22.42,15.82 20.95,14.35 6.02,14.35 download1.2
SWDIO: length 20.6
  Top Layer w0.254: download1.1 6.04,15.62 15.99,15.62 16.88,16.51 16.88,21.97 17.81,22.9 U8.46
UART1_RX: length 18
  Top Layer w0.254: uart2.2 6.69,33.18 10.91,28.96 11.55,28.96 16.11,24.4 U8.43
UART1_TX: length 18.3
  Top Layer w0.254: U8.42 16.62,24.9 11.93,29.59 11.3,29.59 6.46,34.43 uart2.1
UART2_RX: length 41.4
  Top Layer w0.254: 32.63,58.17 32.63,55.88 33.77,54.74 38.85,54.74 39.36,54.23 39.36,35.05 38.98,34.67 30.47,34.67 29.92,34.11 U8.17
UART2_TX: length 41.4
  Top Layer w0.254: uart3.1 33.9,58.16 33.9,56.01 34.54,55.37 39.36,55.37 40,54.74 40,30.86 39.49,30.35 34.41,30.35 33.46,29.4 U8.16
UART3_RX: length 14.5
  Top Layer w0.254: uart5.2 22.84,7.73 23.92,8.81 U8.52
UART3_TX: length 14.8
  Top Layer w0.254: U8.51 23.42,9.33 21.58,7.49 21.58,5.89 uart5.1
UART4_RX: length 37.2
  Top Layer w0.254: uart1.2 41.14,58.14 41.14,55.25 40.51,54.61 40.51,30.48 39.87,29.85 34.79,29.85 33.85,28.9 U8.15
UART4_TX: length 38.4
  Top Layer w0.254: U8.14 34.11,28.4 35.04,29.34 40.12,29.34 41.01,30.23 41.01,54.36 42.41,55.75 42.41,58.16 uart1.1
UART5_RX: length 19.3
  Top Layer w0.254: U8.54 24.92,9.37 26.15,8.13 30.6,8.13 31.36,7.37 31.36,5.9 uart4.2
UART5_TX: length 18.8
  Top Layer w0.254: U8.53 24.42,8.85 25.77,7.49 29.84,7.49 30.13,7.2 uart4.1
UART6_RX: length 24.7
  Top Layer w0.254: U8.38 15.64,26.9 12.31,30.23 11.42,30.23 7.87,33.78 7.87,40.77 6.71,41.92 uart6.2
UART6_TX: length 25.3
  Top Layer w0.254: U8.37 16.03,27.4 12.57,30.86 11.55,30.86 8.5,33.91 8.5,41.28 6.61,43.17 uart6.1
VCAP1: length 4.2
  Top Layer w0.254: U8.31 22.92,32.96 22.73,33.15 C3.2
VCAP2: length 4.1
  Top Layer w0.254: C4.2 18.66,22.1 18.96,22.4 U8.47
$1N4: length 1.9
  Top Layer w0.254: C34.1 R25.1
$1N42: length 1.7
  Top Layer w0.254: R14.2 1.68,2.75 LED8.1
$1N44: length 1.7
  Top Layer w0.254: 60.66,4.42 60.66,4.41 R13.2
$1N46: length 1.6
  Top Layer w0.254: LED6.1 61.18,60 R12.2
$1N48: length 1.7
  Top Layer w0.254: R11.2 4.77,60.17 LED5.1
$1N53: length 2
  Top Layer w0.254: R10.1 10.03,21.38 USB1.10
$1N70: length 1.7
  Bottom Layer w0.254: R4.2 61.87,3.21 LED4.1
$1N71: length 1.6
  Bottom Layer w0.254: R3.2 1.69,2.77 LED2.1
$1N72: length 1.7
  Bottom Layer w0.254: LED1.1 4.78,60.16 R2.2
$1N73: length 1.7
  Bottom Layer w0.254: LED3.1 61.17,59.98 R1.2
$1N91: length 1.5
  Top Layer w0.254: R18.2 11.83,37.57 U3.5
$1N97: length 9.5
  Top Layer w0.762: D6.1 49.83,36.64 54.73,36.64 54.73,40.64 L1.1
$1N100: length 2
  Top Layer w0.254: U7.1 56.38,35.24 C35.1
$1N104: length 4.9
  Top Layer w0.254: C33.2 R25.2 59.19,43.78 U7.6
$1N105: length 2.4
  Top Layer w0.254: R22.2 61.86,36.92 U7.4
$1N107: length 5
  Top Layer w0.254: R23.2 62.19,33.46 R24.1 59.19,33.7 U7.3
$1N109: length 1.8
  Top Layer w0.762: POWER1.2 50.41,26.41 R16.1
$1N110: length 4.8
  Top Layer w0.762: CN1.2 50.61,19.38 U2.1
$1N156: length 3.5
  Top Layer w0.254: USB1.4 9.64,24.38 10.41,25.15 R9.1
$1N178: length 3
  Top Layer w0.254: R6.1 13.16,46.49 Q1.1
$1N179: length 11.8
  Top Layer w0.254: 15.28,42.18 14.88,41.78 10.79,41.78 10.15,42.42 10.15,48.06 D1.1
$1N209: length 8.3
  Top Layer w0.254: U8.45 12.98,23.4 12.69,23.11 R7.2
$1N210: length 8.3
  Top Layer w0.254: R8.2 12.77,24.26 13.13,23.9 U8.44
$1N234: length 4
  Top Layer w0.254: C18.2 28.19,49.28 28.64,48.82 U4.10
$1N238: length 4.7
  Top Layer w0.254: U4.20 28.14,43.14 27.93,42.93 24.41,42.93 24.33,43.01
$1N244: length 2.7
  Top Layer w0.254: C21.2 37.8,45.37 36.58,46.6 U5.12
$1N245: length 3.2
  Top Layer w0.203: C21.1 37.81,43.94 35.42,43.94 35.16,44.21 U5.8
$1N247: length 7.2
  Top Layer w0.203: C36.2 38.98,46.75 38.98,44.96 38.73,44.7 36.95,44.7 36.06,45.6 U5.10

## Copper pours and planes (outline as drawn; the poured copper is in the pictures)
GND on Top Layer: -4.71,71.88 72,71.88 72,-5.46 -4.71,-5.46
GND on Bottom Layer: -3.94,72.14 67.81,72.14 67.81,-4.95 -3.94,-4.95
$1N97 on Top Layer: 56.7,39.37 53.84,39.37 53.59,39.62 53.59,42.29 53.84,42.55 56.63,42.55 57.13,42.05 57.13,39.81

Small or netless copper shapes (teardrops, artwork), in the pictures only: 375 on Top Layer, 54 on Bottom Layer

## Text on the board
Top Silkscreen Layer: 14 | 15 | T | R | G | V | X | Y | 8 | 9 | GND | PB6 | PB7 | DIO | CLK | 4V5 | 7 | 6 | B11 | B10 | 3 | 5 | B | A | 2 | 4 | 1 | BUZZER | IMU | power | SPL06
